# EAGLE design PoE_RFID (EAGLE 8.5.0)

## Sheet 1 of 2
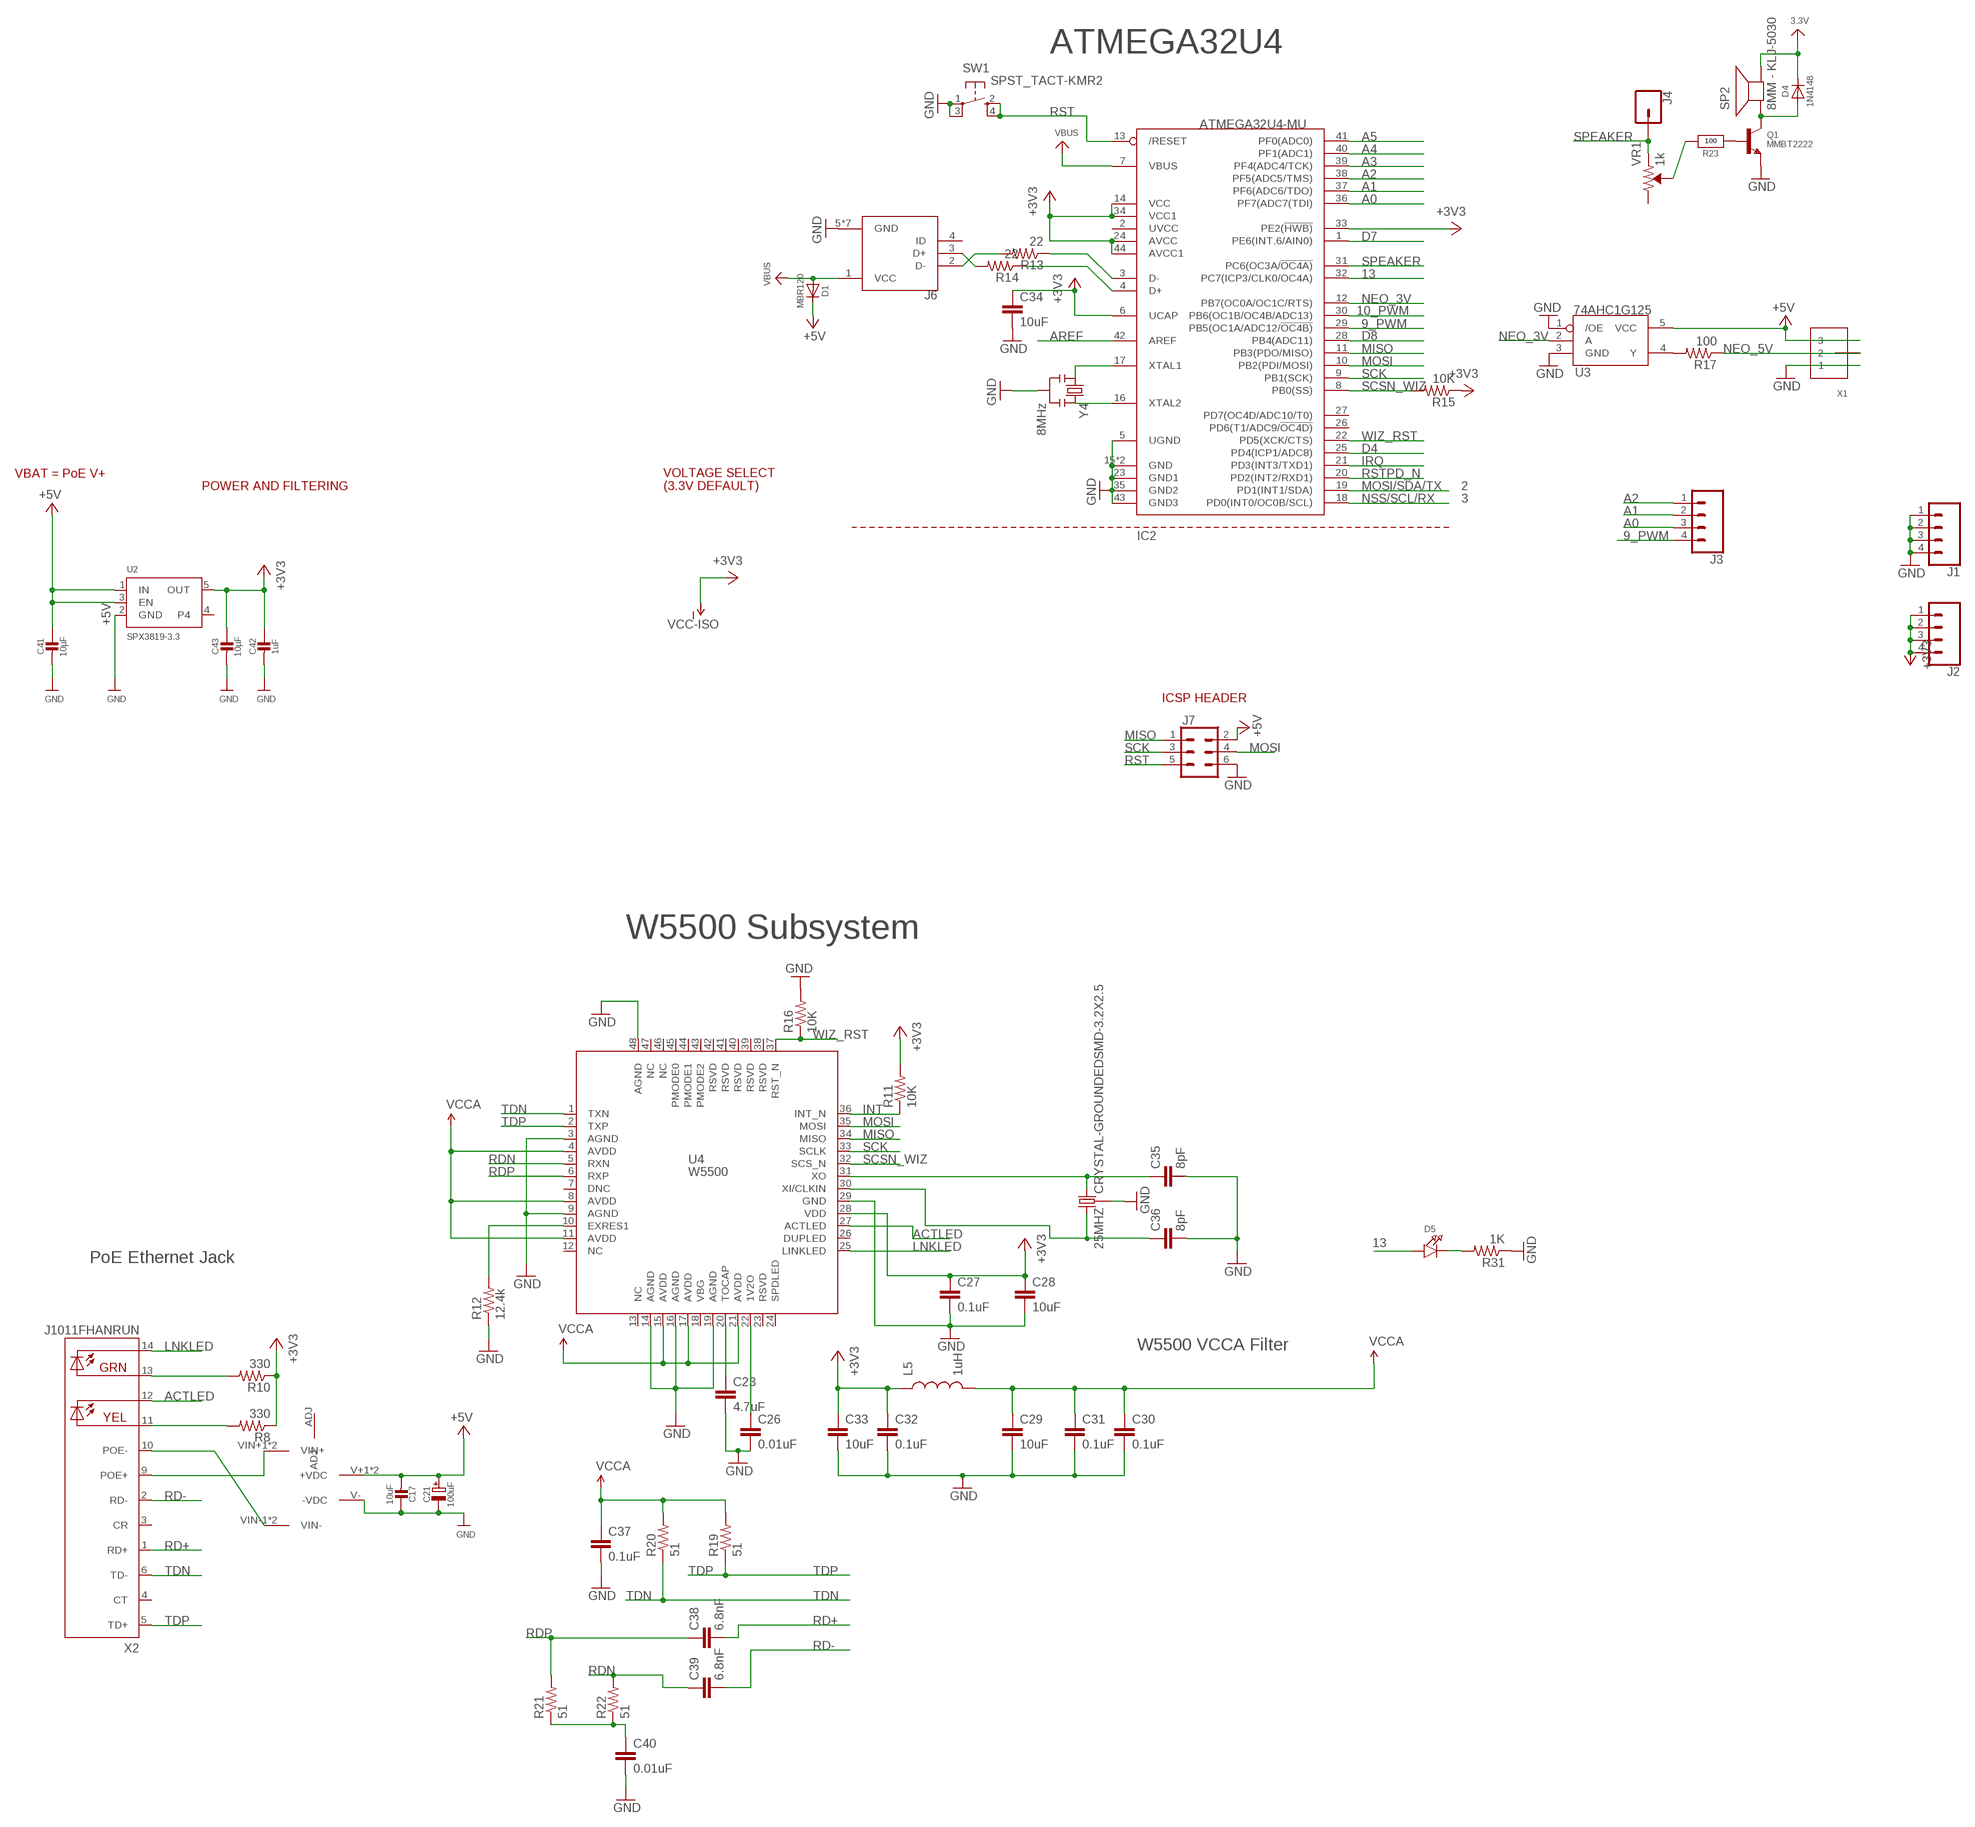
[diagram p0: schematic, sheet 1]

### Parts
25MHZ  CRYSTAL-GROUNDEDSMD-3.2X2.5  [CRYSTAL-SMD-3.2X2.5MM]
C17  10uF  CAP_CERAMIC_0805MP  [_0805MP]
C21  100uF  CAP_ELECTROLYTICPANASONIC_C  [PANASONIC_C]
C23  4.7uF  CAP0603-CAP  [0603-CAP]
C26  0.01uF  CAP0603-CAP  [0603-CAP]
C27  0.1uF  CAP0603-CAP  [0603-CAP]
C28  10uF  CAP0603-CAP  [0603-CAP]
C29  10uF  CAP0603-CAP  [0603-CAP]
C30  0.1uF  CAP0603-CAP  [0603-CAP]
C31  0.1uF  CAP0603-CAP  [0603-CAP]
C32  0.1uF  CAP0603-CAP  [0603-CAP]
C33  10uF  CAP0603-CAP  [0603-CAP]
C34  10uF  CAP0603-CAP  [0603-CAP]
C35  8pF  CAP0603-CAP  [0603-CAP]
C36  8pF  CAP0603-CAP  [0603-CAP]
C37  0.1uF  CAP0603-CAP  [0603-CAP]
C38  6.8nF  CAP0603-CAP  [0603-CAP]
C39  6.8nF  CAP0603-CAP  [0603-CAP]
C40  0.01uF  CAP0603-CAP  [0603-CAP]
C41  10µF  CAP_CERAMIC0603_NO  [0603-NO]
C42  1uF  CAP_CERAMIC0603_NO  [0603-NO]
C43  10µF  CAP_CERAMIC0603_NO  [0603-NO]
D1  MBR120  DIODESOD-123  [SOD-123]
D4  1N4148  DIODESOD-323  [SOD-323]
D5  LED0805_NOOUTLINE  [CHIPLED_0805_NOOUTLINE]
IC2  ATMEGA32U4-MU  [TQFN44_7MM]
J1  CONN_04  [1X04]
J2  CONN_04  [1X04]
J3  CONN_041X04_NO_SILK  [1X04_NO_SILK]
J4  CONN_01  [1X01]
J6  10103594-0001LF  [FCI_10103594-0001LF]
J7  CONN_03X2NO_SILK  [2X3-NS]
L5  1uH  INDUCTOR0603  [0603]
Q1  MMBT2222  TRANSISTOR_NPNWIDE  [SOT23-WIDE]
R8  330  RESISTOR0603-RES  [0603-RES]
R10  330  RESISTOR0603-RES  [0603-RES]
R11  10K  RESISTOR0603-RES  [0603-RES]
R12  12.4k  RESISTOR0603-RES  [0603-RES]
R13  22  RESISTOR0603-RES  [0603-RES]
R14  22  RESISTOR0603-RES  [0603-RES]
R15  10K  RESISTOR0603-RES  [0603-RES]
R16  10K  RESISTOR0603-RES  [0603-RES]
R17  100  RESISTOR0603-RES  [0603-RES]
R19  51  RESISTOR0603-RES  [0603-RES]
R20  51  RESISTOR0603-RES  [0603-RES]
R21  51  RESISTOR0603-RES  [0603-RES]
R22  51  RESISTOR0603-RES  [0603-RES]
R23  100  RESISTOR_0603_NOOUT  [0603-NO]
R31  1K  RESISTOR0603-RES  [0603-RES]
SP2  8MM - KLJ-5030  SPEAKER_BUZZER5MM  [BUZZER_SMT_5MM]
SW1  SPST_TACT-KMR2  [KMR2]
U2  SPX3819-3.3  VREG_SOT23-5  [SOT23-5]
U3  74AHC1G125  [SOT23-5]
U4  W5500  [W5500]
U$1  SILVERTEL_POEMICRO  [AG9900]
VR1  1k  TRIMPOT-SMD-3MM-OPEN-1/10W-25%  [TRIMPOT-SMD-TC33X]
X1  TERMBLOCK_1X3  [TERMBLOCK_1X3-3.5MM]
X2  J1011FHANRUN  [HANRUN_POE]
Y4  8MHz  RESONATORSMD  [RESONATOR-SMD]

### Nets
3.3V: D4.C SP2.-
9_PWM: IC2.29(PB5(OC1A/ADC12/!OC4B)) J3.4
10_PWM: IC2.30(PB6(OC1B/OC4B/ADC13))
13: D5.A IC2.32(PC7(ICP3/CLK0/OC4A))
+3V3: C27.1 C28.1 C32.1 C33.1 C34.1 C42.1 C43.1 IC2.6(UCAP) IC2.14(VCC) IC2.24(AVCC) IC2.33(PE2(!HWB)) IC2.34(VCC1) IC2.44(AVCC1) J2.1 J2.2 J2.3 J2.4 L5.1 R8.1 R10.1 R11.2 R15.1 U2.5(OUT) U4.28(VDD) ; supply symbol labelled VCC-ISO ; also sheet 2
+5V [usbvcc]: C17.2 C21.+ C41.1 D1.C J7.2 U2.1(IN) U2.3(EN) U3.5(VCC) U$1.V+1(+VDC) U$1.V+2(+VDC) X1.3
A0: IC2.36(PF7(ADC7(TDI)) J3.3
A1: IC2.37(PF6(ADC6/TDO)) J3.2
A2: IC2.38(PF5(ADC5/TMS)) J3.1
A3: IC2.39(PF4(ADC4/TCK))
A4: IC2.40(PF1(ADC1))
A5: IC2.41(PF0(ADC0))
ACTLED: U4.27(ACTLED) X2.12(YEL-C)
AREF: IC2.42(AREF)
D4: IC2.25(PD4(ICP1/ADC8))
D7: IC2.1(PE6(INT.6/AIN0))
D8: IC2.28(PB4(ADC11))
D+: IC2.4(D+) R14.1
D-: IC2.3(D-) R13.1
GND: 25MHZ.2 25MHZ.4 C17.1 C21.- C23.2 C26.2 C27.2 C28.2 C29.2 C30.2 C31.2 C32.2 C33.2 C34.2 C35.2 C36.2 C37.2 C40.2 C41.2 C42.2 C43.2 IC2.5(UGND) IC2.15(GND) IC2.23(GND1) IC2.35(GND2) IC2.43(GND3) IC2.THERMAL(GND) J1.1 J1.2 J1.3 J1.4 J6.5(GND) J6.P1(GND) J6.P2(GND) J6.P3(GND) J6.P4(GND) J6.P5(GND) J6.P6(GND) J7.6 Q1.2(E) R12.1 R16.2 R31.1 SW1.1(P) SW1.3(P1) U2.2(GND) U3.1(/OE) U3.3(GND) U4.3(AGND) U4.9(AGND) U4.14(AGND) U4.16(AGND) U4.19(AGND) U4.29(GND) U4.48(AGND) U$1.V-(-VDC) X1.1 Y4.2 ; also sheet 2
INT: R11.1 U4.36(INT_N)
IRQ: IC2.21(PD3(INT3/TXD1)) ; also sheet 2
LNKLED: U4.25(LINKLED) X2.14(GRN-C)
MISO: IC2.11(PB3(PDO/MISO)) J7.1 U4.34(MISO)
MOSI: IC2.10(PB2(PDI/MOSI)) J7.4 U4.35(MOSI)
MOSI/SDA/TX: IC2.19(PD1(INT1/SDA)) ; also sheet 2
N$6: U$1.VIN-1(VIN-) U$1.VIN-2(VIN-) X2.10(POE-)
N$15: U$1.VIN+1(VIN+) U$1.VIN+2(VIN+) X2.9(POE+)
N$16: C26.1 U4.22(1V2O)
N$17: IC2.16(XTAL2) Y4.3
N$18: C23.1 U4.20(TOCAP)
N$19: R17.2 U3.4(Y)
N$20: R12.2 U4.10(EXRES1)
N$21: IC2.17(XTAL1) Y4.1
N$22: J6.3(D+) R14.2
N$23: C40.1 R21.1 R22.1
N$24: J6.2(D-) R13.2
N$25: 25MHZ.3 C35.1 U4.31(XO)
N$26: 25MHZ.1 C36.1 U4.30(XI/CLKIN)
N$27: R8.2 X2.11(YEL-A)
N$28: R10.2 X2.13(GRN-A)
N$29: Q1.1(B) R23.1
N$30: D4.A Q1.3(C) SP2.+
N$31: R23.2 VR1.2(WIPER)
N$33: D5.C R31.2
NEO_3V: IC2.12(PB7(OC0A/OC1C/RTS)) U3.2(A)
NEO_5V: R17.1 X1.2
NSS/SCL/RX: IC2.18(PD0(INT0/OC0B/SCL)) ; also sheet 2
RD+: C38.2 X2.1(RD+)
RD-: C39.2 X2.2(RD-)
RDN: C39.1 R22.2 U4.5(RXN)
RDP: C38.1 R21.2 U4.6(RXP)
RST: IC2.13(/RESET) J7.5 SW1.2(S) SW1.4(S1)
RSTPD_N: IC2.20(PD2(INT2/RXD1)) ; also sheet 2
SCK: IC2.9(PB1(SCK)) J7.3 U4.33(SCLK)
SCSN_WIZ: IC2.8(PB0(SS)) R15.2 U4.32(SCS_N)
SPEAKER: IC2.31(PC6(OC3A/!OC4A)) J4.1 VR1.3(CCW)
TDN: R20.1 U4.1(TXN) X2.6(TD-)
TDP: R19.1 U4.2(TXP) X2.5(TD+)
VBUS: D1.A IC2.7(VBUS) J6.1(VCC)
VCCA: C29.1 C30.1 C31.1 C37.1 L5.2 R19.2 R20.2 U4.4(AVDD) U4.8(AVDD) U4.11(AVDD) U4.15(AVDD) U4.17(AVDD) U4.21(AVDD)
WIZ_RST: IC2.22(PD5(XCK/CTS)) R16.1 U4.37(RST_N)
Unconnected: IC2.2(UVCC) IC2.26(PD6(T1/ADC9/!OC4D)) IC2.27(PD7(OC4D/ADC10/T0)) J6.4(ID) U2.4 U4.7(DNC) U4.12(NC) U4.13(NC) U4.18(VBG) U4.23(RSVD) U4.24(SPDLED) U4.26(DUPLED) U4.38(RSVD) U4.39(RSVD) U4.40(RSVD) U4.41(RSVD) U4.42(RSVD) U4.43(PMODE2) U4.44(PMODE1) U4.45(PMODE0) U4.46(NC) U4.47(NC) U$1.ADJ VR1.1(CW) X2.3(CR) X2.4(CT)

### Notes on the sheet
- ATMEGA32U4
- VBAT = PoE V+
- POWER AND FILTERING
- VOLTAGE SELECT
  (3.3V DEFAULT)
- 2
- 3
- ICSP HEADER
- W5500 Subsystem
- PoE Ethernet Jack
- W5500 VCCA Filter

## Sheet 2 of 2
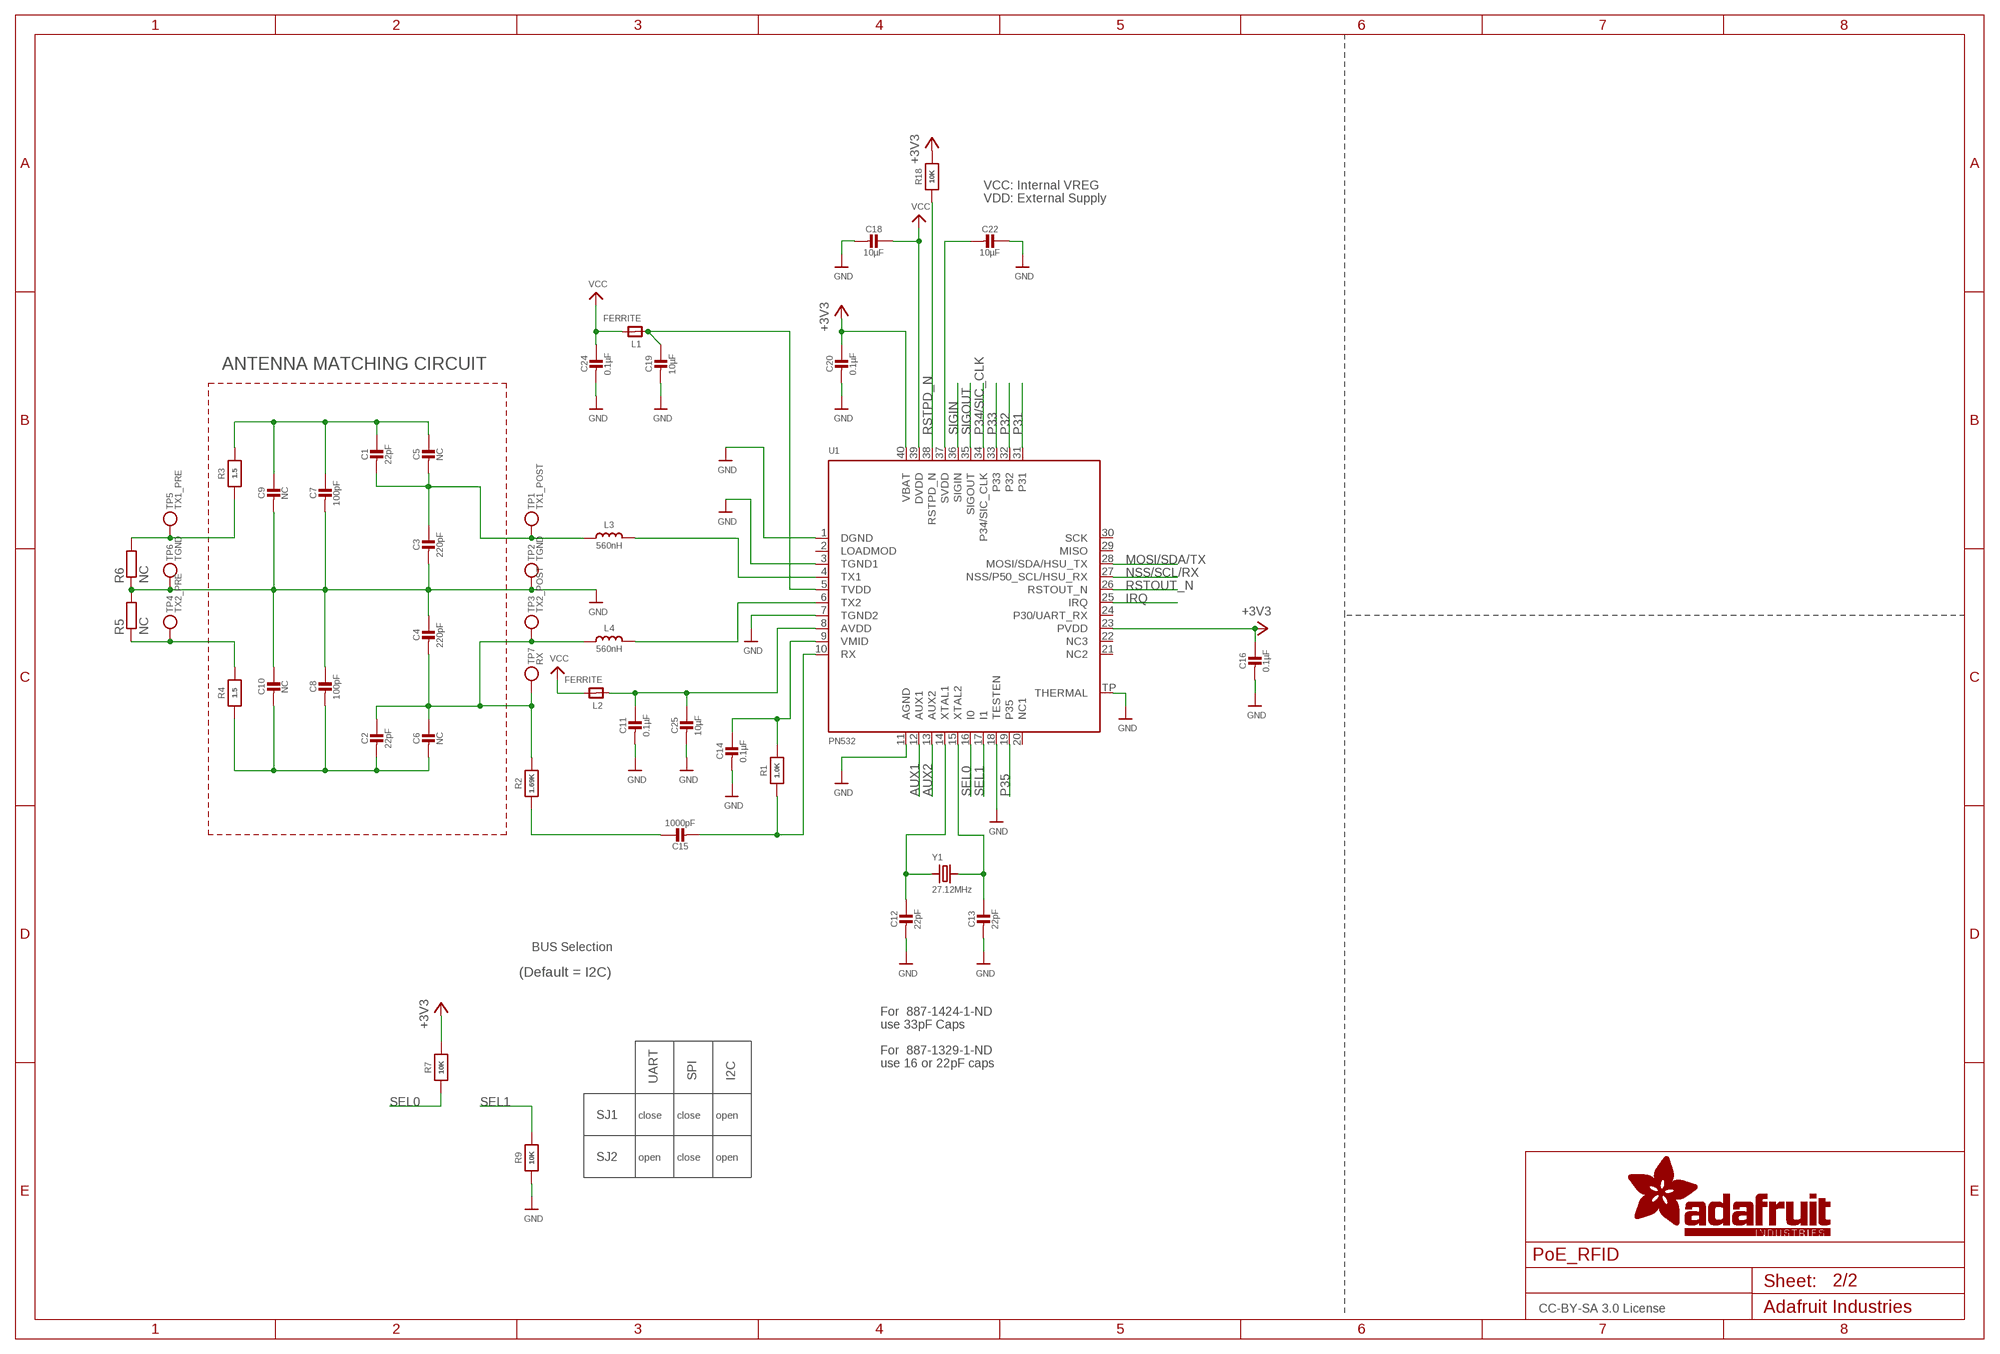
[diagram p1: schematic, sheet 2]

### Parts
C1  22pF  CAP_CERAMIC0603_NO  [0603-NO]
C2  22pF  CAP_CERAMIC0603_NO  [0603-NO]
C3  220pF  CAP_CERAMIC0603_NO  [0603-NO]
C4  220pF  CAP_CERAMIC0603_NO  [0603-NO]
C5  NC  CAP_CERAMIC0603_NO  [0603-NO]
C6  NC  CAP_CERAMIC0603_NO  [0603-NO]
C7  100pF  CAP_CERAMIC0603_NO  [0603-NO]
C8  100pF  CAP_CERAMIC0603_NO  [0603-NO]
C9  NC  CAP_CERAMIC0603_NO  [0603-NO]
C10  NC  CAP_CERAMIC0603_NO  [0603-NO]
C11  0.1µF  CAP_CERAMIC0603_NO  [0603-NO]
C12  22pF  CAP_CERAMIC0603_NO  [0603-NO]
C13  22pF  CAP_CERAMIC0603_NO  [0603-NO]
C14  0.1µF  CAP_CERAMIC0603_NO  [0603-NO]
C15  1000pF  CAP_CERAMIC0603_NO  [0603-NO]
C16  0.1µF  CAP_CERAMIC0603_NO  [0603-NO]
C18  10µF  CAP_CERAMIC0603_NO  [0603-NO]
C19  10µF  CAP_CERAMIC0603_NO  [0603-NO]
C20  0.1µF  CAP_CERAMIC0603_NO  [0603-NO]
C22  10µF  CAP_CERAMIC0603_NO  [0603-NO]
C24  0.1µF  CAP_CERAMIC0603_NO  [0603-NO]
C25  10µF  CAP_CERAMIC0603_NO  [0603-NO]
L1  FERRITE  FERRITE_0603  [_0603]
L2  FERRITE  FERRITE_0603  [_0603]
L3  560nH  INDUCTOR0603_NO  [0603-NO]
L4  560nH  INDUCTOR0603_NO  [0603-NO]
R1  1.0K  RESISTOR_0603_NOOUT  [0603-NO]
R2  1.69K  RESISTOR_0603_NOOUT  [0603-NO]
R3  1.5  RESISTOR_0603_NOOUT  [0603-NO]
R4  1.5  RESISTOR_0603_NOOUT  [0603-NO]
R5  NC  R-EU_R0201  [R0201]
R6  NC  R-EU_R0201  [R0201]
R7  10K  RESISTOR_0603_NOOUT  [0603-NO]
R9  10K  RESISTOR_0603_NOOUT  [0603-NO]
R18  10K  RESISTOR_0603_NOOUT  [0603-NO]
TP1  TX1_POST  TESTPOINT1.5X2.0MM_NOCREAM  [PAD-1.5X2.0]
TP2  TGND  TESTPOINT1.5X2.0MM_NOCREAM  [PAD-1.5X2.0]
TP3  TX2_POST  TESTPOINT1.5X2.0MM_NOCREAM  [PAD-1.5X2.0]
TP4  TX2_PRE  TESTPOINT1.5X2.0MM_NOCREAM  [PAD-1.5X2.0]
TP5  TX1_PRE  TESTPOINT1.5X2.0MM_NOCREAM  [PAD-1.5X2.0]
TP6  TGND  TESTPOINT1.5X2.0MM_NOCREAM  [PAD-1.5X2.0]
TP7  RX  TESTPOINT1.5X2.0MM_NOCREAM  [PAD-1.5X2.0]
U1  PN532  [HVQFN40-6X6]
Y1  27.12MHz  CRYSTAL3.2X2.5  [CRYSTAL_3.2X2.5]

### Nets
+3V3: C16.1 C20.1 R7.2 R18.2 U1.23(PVDD) U1.40(VBAT) ; also sheet 1
AUX1: U1.12(AUX1)
AUX2: U1.13(AUX2)
GND: C3.2 C4.1 C7.2 C8.1 C9.2 C10.1 C11.2 C12.2 C13.2 C14.2 C16.2 C18.2 C19.2 C20.2 C22.1 C24.2 C25.2 R5.2 R6.1 R9.1 TP2.P$1 TP6.P$1 U1.1(DGND) U1.3(TGND1) U1.7(TGND2) U1.11(AGND) U1.18(TESTEN) U1.TP(THERMAL) ; also sheet 1
IRQ: U1.25(IRQ) ; also sheet 1
MOSI/SDA/TX: U1.28(MOSI/SDA/HSU_TX) ; also sheet 1
N$1: L3.2 U1.4(TX1)
N$2: L4.2 U1.6(TX2)
N$3: C1.2 C3.1 C5.2 L3.1 TP1.P$1
N$4: R3.1 R6.2 TP5.P$1
N$5: R4.2 R5.1 TP4.P$1
N$7: C12.1 U1.14(XTAL1) Y1.1
N$8: C13.1 U1.15(XTAL2) Y1.2
N$9: C15.1 R2.1
N$10: C14.1 R1.2 U1.9(VMID)
N$11: C15.2 R1.1 U1.10(RX)
N$12: C2.1 C4.2 C6.1 L4.1 R2.2 TP3.P$1 TP7.P$1
N$13: C11.1 C25.1 L2.1 U1.8(AVDD)
N$14: C19.1 L1.1 U1.5(TVDD)
N$55: C22.2 U1.37(SVDD)
NSS/SCL/RX: U1.27(NSS/P50_SCL/HSU_RX) ; also sheet 1
P31: U1.31
P32: U1.32
P33: U1.33
P34/SIC_CLK: U1.34(P34/SIC_CLK)
P35: U1.19(P35)
RSTOUT_N: U1.26(RSTOUT_N)
RSTPD_N: R18.1 U1.38(RSTPD_N) ; also sheet 1
SEL0: R7.1 U1.16(I0)
SEL1: R9.2 U1.17(I1)
SIGIN: U1.36(SIGIN)
SIGOUT: U1.35(SIGOUT)
TX1_ANTENNA: C1.1 C5.1 C7.1 C9.1 R3.2
TX2_ANTENNA: C2.2 C6.2 C8.2 C10.2 R4.1
VCC: C18.1 C24.1 L1.2 L2.2 U1.39(DVDD)
Unconnected: U1.2(LOADMOD) U1.20(NC1) U1.21(NC2) U1.22(NC3) U1.24(P30/UART_RX) U1.29(MISO) U1.30(SCK)

### Notes on the sheet
- VCC: Internal VREG
- VDD: External Supply
- ANTENNA MATCHING CIRCUIT
- BUS Selection
- (Default = I2C)
- For  887-1424-1-ND
- use 33pF Caps
- For  887-1329-1-ND
- use 16 or 22pF caps
- UART | SPI | I2C
- SJ1 | close | close | open
- SJ2 | open | close | open
- CC-BY-SA 3.0 License

## Library data of the parts
25MHZ = SparkFun-Clocks:CRYSTAL-GROUNDED: Crystals w/ Ground Pin (Generic) These are passive quartz crystals, which can be used as a clock source for a microcontroller. Crystal's are usually two-terminal devices. A third terminal may be optionally connected to ground, as recommended by the manufaturer.
C1-C20 C22 C24 C25 C41-C43 = microbuilder:CAP_CERAMIC: Ceramic Capacitors For new designs, use the packages preceded by an '_' character since they are more reliable: The following footprints should be used on most boards: _0402 - Standard footprint for regular board layouts _0603 - Standard footprint for regular board layouts _0805 - Standard footprint for regular board layouts _1206 - Standard footprint for regular board layouts For extremely tight-pitch boards where space is at a premium, the following 'micro-pitch' footprints can be used (smaller pads, no silkscreen outline, etc.): _0402MP - Micro-pitch footprint for very dense/compact boards _0603MP - Micro-pitch footprint for very dense/compact boards _0805MP - Micro-pitch footprint for very dense/compact boards _1206MP - Micro-pitch footprint for very dense/compact boards
C21 = microbuilder:CAP_ELECTROLYTIC: Electrolytic Capacitors SMT PANASONIC_C - Size C Panasonic Electrolytic Aluminum Capacitor 47µF 16V 20% Electrolytic Capacitor [Digikey: PCE3890TR-ND] PANASONIC_D - Size D Panasonic Electrolytic Aluminum Capacitor 100µF 25V 20% Electrolytic Capacitor [Digikey: PCE3898TR-ND] PTH 3.5 mm grid, 8 mm diameter ... 3.5 mm grid, 10 mm diameter ...
C23 C26-C40 = SparkFun-Passives:CAP: Capacitor Standard 0603 ceramic capacitor, and 0.1" leaded capacitor.
D1 D4 = microbuilder:DIODE: Diode SMA Model Volts Amps Type Vf Ir Digikey # Notes SSA34-E3 40V 3A Schottky 480mV @ 3A 200uA @ 40V SSA34-E3/61TGITR-ND CDBA120-G 20V 1A Schottky 500mV @ 1A 500uA @ 20V 641-1014-6-ND REEL MBRA210 10V 2A Schottky 350mV @ 2A 700uA @ 10V MBRA210LT3 SOD-123 Model Volts Amps Type Vf Ir Order # Notes BAT54T1G 30V 200mA Schottky 800mV @ 200mA 2uA @ 25V BAT54T1GOSTR-ND B0530W 30V 500mA Schottky 430mV @ 500mA 130uA @ 30V B0530W-FDICT-ND REEL MBR120 20V 1A Schottky 340mV @ 1A MBR120VLSFT1GOSCT-ND SOD-323 Model Volts Amps Type Vf Ir Order # Notes PMEG2005EJ 20V 500mA Schottky 355mV @ 500mA 568-4110-1-ND ZLLS410 10V 570mA Schottky 380mV @ 570mA ZLLS410CT-ND 1N4148WS 75V 150mA Silicon/Simple 1V 1N4148WSFSCT-ND REEL SOD-523 Model Volts Amps Type Vf Ir Order # Notes BAT54XV2 30V 200mA Schottky 0.8V @ 100mA BAT54XV2CT-ND TB751S 30V 30mA Schottky RB751S-40TE61CT-ND SOT23-R/W (R = Solder Paste/Reflow Ovens, W = Hand-Soldering) Model Volts Amps Type Vf Ir Order # Notes BAT54FILM 40V 300mA Schottky 497-7162-1-ND POWERDI-5 Model Volts Amps Type Vf Ir Order # Notes PDS560 60V 5A Schottky 670mV @ 5A 150uA @ 60V PDS560DICT-ND
D5 = microbuilder:LED: LED 0603 - 0603 Surface Mount Package 2mA: Green LED - Low Power (3.9mcd, 2ma, 1.7Vf) - Digikey: 475-2709-2-ND Orange LED - Low Power (9.8mcd, 2ma, 1.8Vf) - Digikey: 475-1194-2-ND Red LED - Low Power (5mcd, 2ma, 1.8Vf) - Digikey: 475-1195-2-ND Yellow LED - Low Power (7mcd, 2ma, 1.8Vf) - Digikey: 475-1196-2-ND 5mA: Blue LED - Low Power (17mcd, 5ma, 2.9Vf) - Digikey: LNJ937W8CRACT-ND 0805 - 0805 Surface Mount Package 2mA: Red LED (8.8mcd, 2mA, 1.8Vf, Clear) - Low Power [Digikey: 475-2510-1-ND] Green LED (5mcd, 2mA, 1.8Vf, Clear) - Low Power [Digikey: 475-2730-1-ND] Yellow LED (11.3mcd, 2mA, 1.8Vf, Clear) - Low Power [Digikey: 475-2555-1-ND] 20mA: Red LED (104mcd, 20mA, Diffused) - LS R976 [Digikey: 475-1278-6-ND] Red LED (12mcd, 20mA, 2.0Vf, Clear) - APT2012EC [Digikey: 754-1128-1-ND] Green LED (15mcd, 20mA, 2.2Vf, Clear) - APT2012GC [Digikey: 754-1131-1-ND] Orange LED (160mcd, 20mA, 2.1Vf, Clear) - APT2012SECK [Digikey: 754-1130-1-ND] 1206 - 1206 Surface Mount Package Green LED (26mcd, 20mA, Diffused) - LG N971 [Digikey: 475-1407-6-ND] Red LED (15mcd, 20mA, Diffused) - LH N974 [Digikey: 475-1416-6-ND] Cree - Cree High-Power Surface Mount LEDs XPEBWT-L1-0000-00D50 - White 111lm 350mA 2.9Vf 6200K 110° XTEAWT-00-0000-00000LEE3 - White 114lm 350mA 2.85Vf 5000K 115° Everlight - Everlight 45-21 Series Surface Mount LEDs 45-21/QK2C-B2832AC2CB2/2T - Warm White 2000mcd 20mA 3.25Vf 3050K 120° 45-21/LK2C-B38452C4CB2/2T - Nuetral White 2000mcd 20mA 3.25Vf 4150K 120° 45-21/LK2C-B50634C6CB2/2T - Cold White 2200mcd 20mA 3.25Vf 5650K 120° PLCC2 Reverse Mount LS T77K-J1L2-1-0-2-R18-Z - Red 11.25mcd 2mA 1.8Vf 630nm 120° LO T77K-L1M2-24-Z - Orange 19.6mcd 2mA 1.8Vf 606nm 120° LY T77K-K2M1-26-Z - Yellow 15.7mcd 2mA 1.8Vf 587nm 120°
IC2 = microbuilder:ATMEGA32U4: http://www.ladyada.net/library/eagle
J1-J3 = SparkFun-Connectors:CONN_04: Multi connection point. Often used as Generic Header-pin footprint for 0.1 inch spaced/style header connections On any of the 0.1 inch spaced packages, you can populate with these: Break Away Headers - Straight <https://www.sparkfun.com/products/116> (PRT-00116) Break Away Male Headers - Right Angle <https://www.sparkfun.com/products/553> (PRT-00553) Female Headers <https://www.sparkfun.com/products/115> (PRT-00115) Break Away Headers - Machine Pin <https://www.sparkfun.com/products/117> (PRT-00117) Break Away Female Headers - Swiss Machine Pin <https://www.sparkfun.com/products/743> (PRT-00743) For SCREWTERMINALS and SPRING TERMINALS visit here: Screw Terimnals on SparkFun.com <https://www.sparkfun.com/search/results?term=Screw+Terminals> (5mm/3.5mm/2.54mm spacing) This device is also useful as a general connection point to wire up your design to another part of your project. Our various solder wires solder well into these plated through hole pads. Hook-Up Wire - Assortment (Stranded, 22 AWG) <https://www.sparkfun.com/products/11375> (PRT-11375) Hook-Up Wire - Assortment (Solid Core, 22 AWG) <https://www.sparkfun.com/products/11367> (PRT-11367) View the entire wire category on our website here <https://www.sparkfun.com/categories/141> Special notes: Molex polarized connector foot print use with SKU : PRT-08231 with associated crimp pins and housings. 1MM SMD Version SKU: PRT-10208; PROD_ID: CONN-09696
J4 = SparkFun-Connectors:CONN_01: Single connection point. Often used as Generic Header-pin footprint for 0.1 inch spaced/style header connections On any of the 0.1 inch spaced packages, you can populate with these: Break Away Headers - Straight <https://www.sparkfun.com/products/116> (PRT-00116) Break Away Male Headers - Right Angle <https://www.sparkfun.com/products/553> (PRT-00553) Female Headers <https://www.sparkfun.com/products/115> (PRT-00115) Break Away Headers - Machine Pin <https://www.sparkfun.com/products/117> (PRT-00117) Break Away Female Headers - Swiss Machine Pin <https://www.sparkfun.com/products/743> (PRT-00743) This device is also useful as a general connection point to wire up your design to another part of your project. Our various solder wires solder well into these plated through hole pads. Hook-Up Wire - Assortment (Stranded, 22 AWG) <https://www.sparkfun.com/products/11375> (PRT-11375) Hook-Up Wire - Assortment (Solid Core, 22 AWG) <https://www.sparkfun.com/products/11367> (PRT-11367) View the entire wire category on our website here <https://www.sparkfun.com/categories/141> Special notes: SMTSO-256-ET is a "flush mount" nut for a 4-40 screw. We mostly use this on specialty testbeds; it is a nice way to connect hardware to your PCB at an adjustable hieght. Also note, the SNAP packages are for using a snappable style connector. We sell a baggie of snaps and they are also used on two LilyPad designs: Snap Assortment - 30 pack (male and female) <https://www.sparkfun.com/products/11347> (DEV-11347) LilyPad Arduino SimpleSnap <https://www.sparkfun.com/products/10941> (DEV-10941) LilyPad SimpleSnap Protoboard <https://www.sparkfun.com/products/10940> (DEV-10940)
J6 = 10103594-0001LF:10103594-0001LF: Conn Micro USB Type B RCP 5 POS 0.65mm Solder RA SMD 5 Terminal 1 Port T/R; AVAILABILITY: Good; DESCRIPTION: Conn Micro USB Type B RCP 5 POS 0.65mm Solder RA SMD 5 Terminal 1 Port T/R; MF: FCI; MP: 10103594-0001LF; PACKAGE: None; PRICE: 0.40 USD
J7 = SparkFun-Connectors:CONN_03X2: Multi connection point. Often used as Generic Header-pin footprint for 0.1 inch spaced/style header connections You can populate with any combo of single row headers, but if you'd like an exact match, check these: Header - 2x3 (Male, 0.1") <https://www.sparkfun.com/products/12807> (PRT-12807) Header - 2x3 (Female, 0.1") <https://www.sparkfun.com/products/13010> (PRT-13010) 2x3 Pin Shrouded Header <https://www.sparkfun.com/products/10877> (PRT-10877) On any of the 0.1 inch spaced packages, you can populate with these: Break Away Headers - Straight <https://www.sparkfun.com/products/116> (PRT-00116) Break Away Male Headers - Right Angle <https://www.sparkfun.com/products/553> (PRT-00553) Female Headers <https://www.sparkfun.com/products/115> (PRT-00115) Break Away Headers - Machine Pin <https://www.sparkfun.com/products/117> (PRT-00117) Break Away Female Headers - Swiss Machine Pin <https://www.sparkfun.com/products/743> (PRT-00743) Special note: the shrouded connector mates well with our 3x2 ribbon cables: Ribbon Crimp Connector - 6-pin (2x3, Female) <https://www.sparkfun.com/products/10651> (PRT-10651) Ribbon Cable - 6 wire (15ft) <https://www.sparkfun.com/products/10646> (PRT-10646)
L1 L2 = microbuilder:FERRITE: Ferrite Bead 0603 MMZ1608B121C - 120 Ohm @ 100MHz, 600mA, 0.15 Ohm DC Resistance - Digikey: 445-2164-1-ND BK1608HW121-T - 120 Ohm, 600mA Ferrite Chip - Digikey: 587-1876-2-ND 0805 HZ0805B272R-10 - 2.7K Ohm @ 100MHz, 200mA, 0.8 Ohm DC Resistance - Digikey: 240-2504-1-ND (see also Murata BLM21BD272SN1L) MMZ2012Y152B - 1.5K Ohm @ 100MHz, 500mA, 0.4 Ohm DC Resistance - Digikey: 445-1560-1-ND - Mainly for high frequency (80-400MHz) MMZ2012R102A - 1K Ohm @ 100MHz, 500mA, 0.3 Ohm DC Resistance - Digikey: 445-1555-2-ND - More general purpose (10-200MHz)
L3 L4 = microbuilder:INDUCTOR: Inductors
L5 = SparkFun-Passives:INDUCTOR: Inductors
Q1 = microbuilder:TRANSISTOR_NPN: NPN Transistor Transistor (NPN) 500mA 45V - BC817 [Digikey: 568-1631-1-ND] Transistor (NPN) 500mA 45V - BC817,215 [Mouser: 771-BC817-T/R] SOT23-R - SOT23 footprint optimised for use with solder paste and reflow ovens. SOT23-W - SOT23 footprint optimised for hand-soldering (larger pads).
R1-R4 R7 R9 R18 R23 = microbuilder:RESISTOR: Resistors For new designs, use the packages preceded by an '_' character since they are more reliable: The following footprints should be used on most boards: _0402 - Standard footprint for regular board layouts _0603 - Standard footprint for regular board layouts _0805 - Standard footprint for regular board layouts _1206 - Standard footprint for regular board layouts For extremely tight-pitch boards where space is at a premium, the following 'micro-pitch' footprints can be used (smaller pads, no silkscreen outline, etc.): _0402MP - Micro-pitch footprint for very dense/compact boards _0603MP - Micro-pitch footprint for very dense/compact boards _0805MP - Micro-pitch footprint for very dense/compact boards _1206MP - Micro-pitch footprint for very dense/compact boards
R5 R6 = rcl:R-EU_: RESISTOR, European symbol
R8 R10-R17 R19-R22 R31 = SparkFun-Passives:RESISTOR: Resistor Basic schematic elements and footprints for 0603, 1206, and PTH resistors.
SP2 = microbuilder:SPEAKER: SPEAKER Source: Buerklin Added PS12 (for part # PS1240 piezo) http://www.ladyada.net/library/pcb/eaglelibrary.html
SW1 = adafruit:SPST_TACT: SMT 6mm switch, EVQQ2 series http://www.ladyada.net/library/eagle
TP1-TP7 = microbuilder:TESTPOINT: Test Point Various test points for characterisation and PCB testing TESTPOINT_SMT - Compact Surface Mount Test Point [Digikey: 5016KTR-ND]
U1 = microbuilder:PN532: PN532 - Near Field Communication (NFC) controller Highly integrated transceiver module for contactless communication at 13.56 MHz (14443A/MIFARE, FeliCa, I4443B)
U2 = microbuilder:VREG_SOT23-5: SOT23-5 Fixed Voltage Regulators Part Current Out V Out V In V Dropout θJA (°C/W) TJ (°C) Digikey Part No. ADP121 150mA 3.3V 3.4-5.5V 0.09V @ 150mA -- -- ADP121-AUJZ33R7CT-ND ADP121 150mA 3.0V 3.1-5.5V 0.09V @ 150mA -- -- ADP121-AUJZ30R7CT-ND ADP122 300mA 3.3V 3.4-5.5V 0.085V @ 300mA -- -- ADP122AUJZ-3.3-R7CT-ND ADP1712 300mA 3.3V 3.5-5.5V 0.17V @ 300mA -- -- ADP1712AUJZ-3.3-R7TR-ND AP7311 (Low Cost) 150mA 3.3V 3.5-6V 0.15V @ 150mA -- -- AP7311-33WG-7DICT-ND LD39015M18R 150mA 1.8V 1.9V-5.5V 0.08V @ 100mA -- -- 497-6977-1-ND LP2985A-33DBVR 150mA 3.3V 3.3-16V 0.28V @ 150mA 206 150 296-18479-1-ND MCP1824T-3302E/OT 300mA 3.3V 3.5V-6V 0.2V @ 300mA -- -- MCP1824T-3302E/OTCT-ND MIC5205-2.5YM5 TR 150mA 2.5V 2.7-16V 0.165V @ 150mA -- -- 576-1257-2-ND MIC5205-3.0YM5 TR 150mA 3.0V 3.2V-16V 0.165V @ 150mA -- -- 576-1258-2-ND MIC5205-3.3YM5 TR 150mA 3.3V 3.5V-16V 0.165V @ 150mA -- -- 576-1259-2-ND TPS780330220 150mA 3.3V+2.2V 3.6-5.5V 250mV Max -- -- 296-23332-1-ND TDA3663/N1,135 100mA 3.3V 3.5-45V 0.18V @ 50mA -- -- 568-5343-1-ND Max operating temp can be calculated using θJA, TJ (max junction temperature), and power in watts. Set the "Maximum Ambient Temperature" until it reaches TJ ("Max Junction Temperature"), which is the absolute limit for safe use of the regulator: Heat Sink Temperature Calculator <http://www.daycounter.com/Calculators/Heat-Sink-Temperature-Calculator.phtml> For example, With 12V source into a 3.3V LP2985 and a 30mA load, we are dissipating (12V-3.3V) * 0.03A = 0.261W. With a θJA of 206 °C/W, a TJ of 150°C, and 261mW we can safely use the chip without a heat sink up to 75°C (=147.1°C Junction Temperature).
U3 = SparkFun-DigitalIC:74AHC1G125: Single bus buffer gate with 3-state output; PROD_ID: IC-11920
U4 = W5500:W5500
U$1 = Heep:SILVERTEL_POE
VR1 = SparkFun-Resistors:TRIMPOT: Trimming Potentiometer (Trimpot) Three-terminal potentiometers, with an adjustable wiper and two adjustable resistors. A pot can be used to create a configurable voltage divider, or as a variable resistor. "Trimpots" are a subset of potentiometers, usually intended for "set-and-forget" applications. They're often more delicate than standard potentiometers - rated for fewer turns. Variants PTH-KNOB - PTH Trimpot w/ finger-adjustable knob Trimpot 10K with Knob <https://www.sparkfun.com/products/9806> (COM-09806) Datasheet <http://www.sparkfun.com/datasheets/Components/General/TSR-3386.pdf> SMD-3MM-CLOSED-FRAME - SMD 3mm Square Closed-Frame Trimpot Used on e.g. EasyDriver - Stepper Motor Driver <https://www.sparkfun.com/products/12779> Datasheet <http://www.bitechnologies.com/pdfs/22.pdf> (22AR10KTR) SMD-5MM - SMD 5mm Square Closed-Frame Trimpot Used on e.g. IOIO-OTG - V2.2 <https://www.sparkfun.com/products/13613> Datasheet <http://www.vishay.com/docs/51008/ts53.pdf> (TS53YL502MR10) SMD-3MM-1/10W-25% - 3mm Square Open-Frame Trimpot Used on e.g. SparkFun Shapeoko <https://www.sparkfun.com/products/13899> Datasheet <http://www.bourns.com/docs/Product-Datasheets/TC33.pdf> (TC33X-2-103E); PROD_ID: RES-12428; VALUE: 10k
X1 = microbuilder:TERMBLOCK_1X3: 3.5mm Terminal block http://www.ladyada.net/library/pcb/eaglelibrary.html
X2 = Heep:J1011F: PULSEJACK (TM) 1x1 Tab-UP RJ45 10/100 Base-TX RJ45 1x1 Tab-UP with LEDs 8-pin (J1 series) and 6-pin (JP series) integrated magnetics connector, designed to support applications, such as ADSL modems, LAN-on-Motherboard, and Hub and Switches. Source: www.pulseeng.com .. PulseJack-J402.pdf
Y1 = microbuilder:CRYSTAL: Crystals HC49UP - Surface Mount Crystal 4.0MHz 18pF +/-30ppm Surface Mount Crystal [Digikey: 535-9857-1-ND] 12.0 MHz Surface Mount Crystal [Digikey: 535-9869-6-ND] 25.0 MHz Surface Mount Crystal [Digikey: 535-9078-1-ND] 2.5 x 2.0mm - MEMs SMT Crystal 16.0 MHz 10pF 20ppm 2.5 x 2.0mm Crystal [Digikey -40-85°C: 535-10923-1-ND] 3.2 x 2.5mm - MEMs SMT Crystal 12.0 MHz 8pF 15ppm 3.2 x 2.5mm Crystal [Digikey: -10-70°C: 644-1047-1-ND -40-125°C: 644-1128-1-ND] 40~85°C cheaper: 644-1173-6-ND 16.0 MHz 8pF 15ppm 3.2 x 2.5mm Crystal [Digikey: -10-70°C: 644-1049-1-ND -40-125°C: 644-1129-2-ND]-40~85°C cheaper: 644-1175-6-ND 16.0 MHz 10pF 10ppm 3.2 x 2.5mm Crystal [Digikey: 644-1100-1-ND] 27.12 MHz 18pF 30ppm 3.2 x 2.5mm Crystal [Digikey: 887-1424-1-ND] 27.12MHz 10pF 10ppm 3.2 x 2.5mm Crystal [Digikey: 887-1329-1-ND] 4.9 x 1.8mm - MEMs SMT Crystal 32.768 KHz 12.5pF 20ppm 4.9 x 1.8mm Crystal [Digikey: SE2415CT-ND] 8.0 x 3.8mm - Surface Mount Crystal 32.768kHz 12.5pF 20ppm -40°C-85°C [Digikey: 535-9166-2-ND] Cylinder 32.768KHz Cylinder Crystal (2x6mm body) [Ex. Digikey: 300-8341-2-ND]
Y4 = SparkFun:RESONATOR: Resonator Small SMD resonator. This is the itty bitty 10/20MHz resonators with built in caps. CSTCE10M0G55 and CSTCE20M0V53. Footprint has been reviewed closely but hasn't been tested yet.

## Net classes
3 usbvcc: width 0.305 mm, drill 0.483 mm, clearance 0.203 mm

## Board
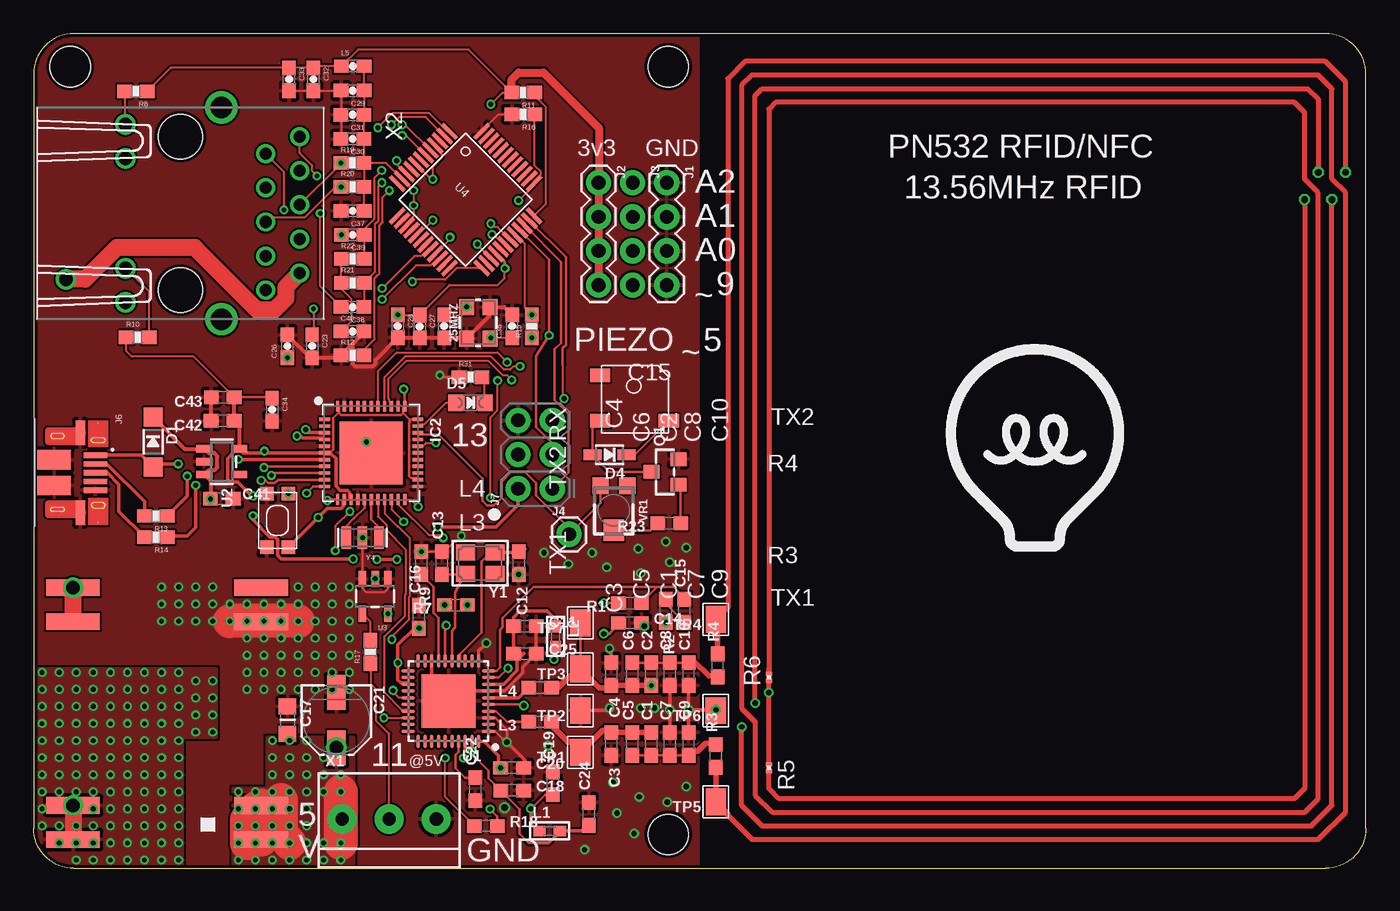
[diagram p2: board, top side]
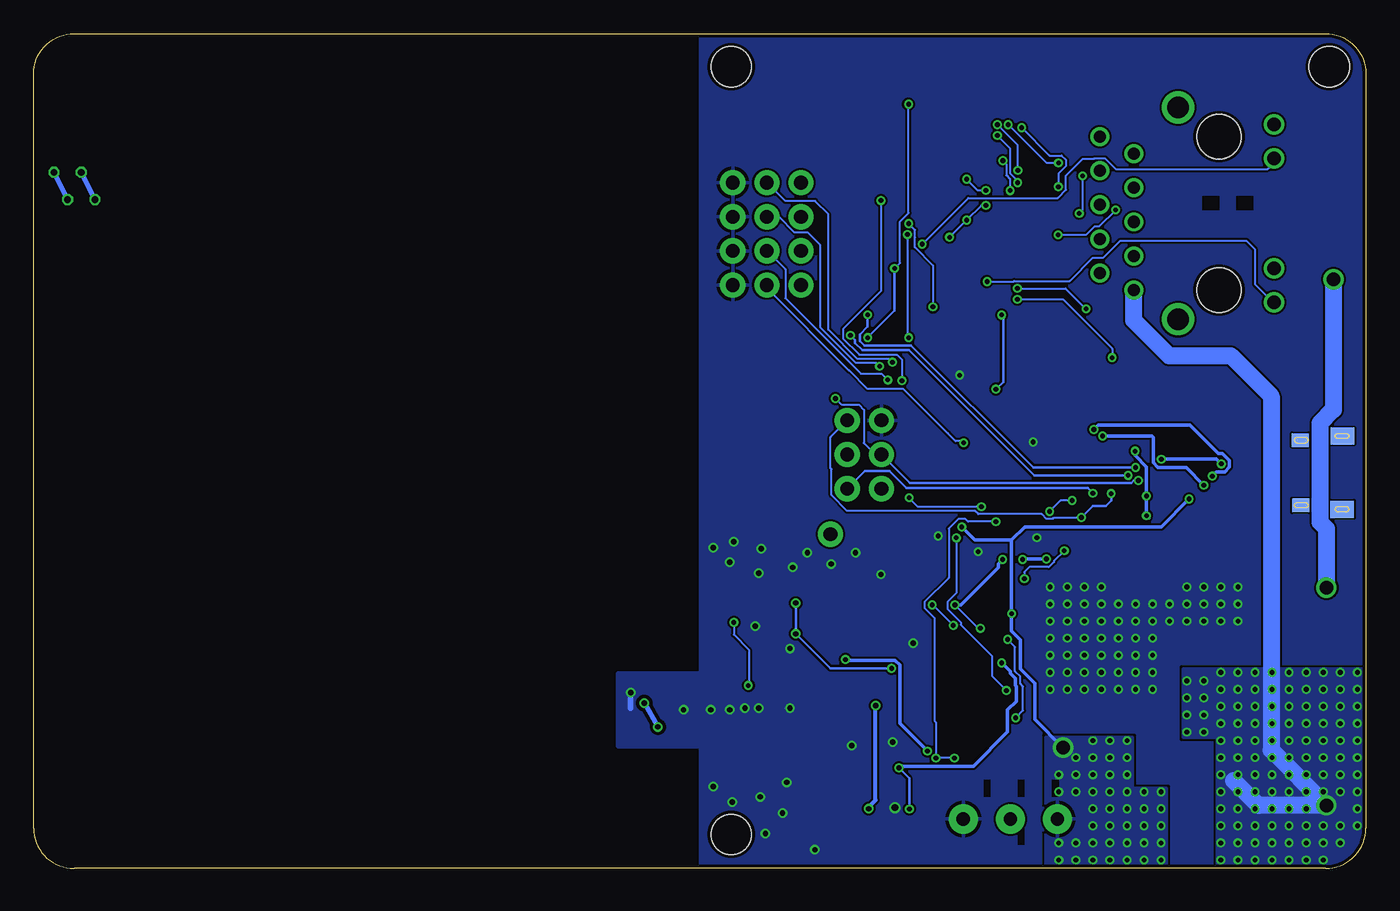
[diagram p3: board, bottom side, seen from below]

Size 99.16 x 62.15 mm. Coordinates in mm from the lower left corner, seen from the top.
Outline: 3,0 96.14,0 arc90 99.16,3 99.16,59.15 arc90 96.14,62.15 3,62.15 arc90 0,59.15 0,3 arc90 3,0
Copper layers (1*16): Top 0.035mm / dielectric 1.5mm / Bottom 0.035mm
Design rules "SeeedStudio_2layer_DRU_no_angle_20140221": minimum track width 6mil, minimum drill 12mil, track to track 6mil, track to pad 6mil, pad to pad 6mil, via to via 6mil, smd to smd 0mil, copper to edge 10mil, drill to drill 10mil, minimum pad ring 10mil, minimum via ring 6mil, stop-mask expansion 2mil, vias tented up to drill 100mil, thermal gap 10mil
Holes 3 mm at 47.23,59.69 47.23,2.54 2.73,59.69
tRestrict: area 29.4,24.9 to 30.1,25; area 28.8,27.2 to 29.1,27.7; area 26.5,25.1 to 27,25.4; area 24.5,27.2 to 24.8,27.7; area 26.3,29.5 to 27.3,29.7; area 29.4,96.3 to 30.1,96.4; area 28.8,98.6 to 29.1,99.1; area 26.5,96.5 to 27,96.8; area 24.5,98.6 to 24.8,99.1; area 26.3,100.8 to 27.3,101.1
bRestrict: area 8.4,49 to 9.7,50; area 10.9,49 to 12.2,50; area 25.4,1.8 to 25.9,3; area 25.4,5.3 to 25.9,6.6; area 22.9,5.3 to 23.4,6.6; area 27.9,5.3 to 28.4,6.6; area 58.5,7.9 to 107.8,45.7; area 58.5,79.2 to 107.8,117.1

### Footprints (pad centres in the part's own frame; a part is rotated, then mirrored left to right if it is on the bottom)
CRYSTAL-SMD-3.2X2.5MM = smd 1.2 x 1.1: 1 -1.175,-0.875; 2 1.175,-0.875; 3 1.175,0.875; 4 -1.175,0.875
0603-NO = smd 1.1 x 1: 1 -0.85,0; 2 0.85,0
_0805MP = smd 1.2 x 1.3: 1 -1.016,0; 2 1.016,0
PANASONIC_C = smd 2.6 x 1.4: + 2.05,0; - -2.05,0
0603-CAP = smd 1.1 x 1: 1 -0.85,0; 2 0.85,0
SOD-123 = smd 1.4 x 1.4: A 1.85,0; C -1.85,0
SOD-323 = smd 1.35 x 0.8: A 1.27,0; C -1.27,0
CHIPLED_0805_NOOUTLINE = smd 1.2 x 1.2: A 0,-1.05; C 0,1.05
TQFN44_7MM = smd 0.25 x 0.8: 1 -2.5,-3.475; 2 -2,-3.475; 3 -1.5,-3.475; 4 -1,-3.475; 5 -0.5,-3.475; 6 0,-3.475; 7 0.5,-3.475; 8 1,-3.475; 9 1.5,-3.475; 10 2,-3.475; 11 2.5,-3.475; 23 2.5,3.475; 24 2,3.475; 25 1.5,3.475; 26 1,3.475; 27 0.5,3.475; 28 0,3.475; 29 -0.5,3.475; 30 -1,3.475; 31 -1.5,3.475; 32 -2,3.475; 33 -2.5,3.475 | smd 0.8 x 0.25: 12 3.475,-2.5; 13 3.475,-2; 14 3.475,-1.5; 15 3.475,-1; 16 3.475,-0.5; 17 3.475,0; 18 3.475,0.5; 19 3.475,1; 20 3.475,1.5; 21 3.475,2; 22 3.475,2.5; 34 -3.475,2.5; 35 -3.475,2; 36 -3.475,1.5; 37 -3.475,1; 38 -3.475,0.5; 39 -3.475,0; 40 -3.475,-0.5; 41 -3.475,-1; 42 -3.475,-1.5; 43 -3.475,-2; 44 -3.475,-2.5 | smd 4.7 x 4.7: THERMAL 0,0
1X04 = drill 1.016 pad 1.88: 1 0,0; 2 2.54,0; 3 5.08,0; 4 7.62,0
1X04_NO_SILK = drill 1.016 pad 1.88: 1 0,0; 2 2.54,0; 3 5.08,0; 4 7.62,0
1X01 = drill 1.016 pad 1.88: 1 0,0
FCI_10103594-0001LF = smd 0.4 x 1.75: 1 -1.3,2.825; 2 -0.65,2.825; 3 0,2.825; 4 0.65,2.825; 5 1.3,2.825 | smd 0.1 x 0.1: P1 -3.7,3; P2 3.7,3 | smd 1.825 x 0.7: P3 -2.987,1.7; P4 2.987,1.7 | smd 1.425 x 2.5: P5 -0.963,-0.25; P6 0.963,-0.25 | smd 1.25 x 1.75 bottom: P$1 -2.731,-0.026; P$2 2.726,-0.018 | smd 1 x 1.25 bottom: P$3 -2.422,3.111; P$4 2.427,3.078
2X3-NS = drill 1.016 pad 1.88: 1 -2.54,-1.27; 2 -2.54,1.27; 3 0,-1.27; 4 0,1.27; 5 2.54,-1.27; 6 2.54,1.27
_0603 = smd 0.9 x 0.8: 1 -0.762,0; 2 0.762,0
0603 = smd 1.1 x 1: 1 -0.85,0; 2 0.85,0
SOT23-WIDE = smd 1 x 1.2: 1 -0.95,-1; 2 0.95,-1; 3 0,1
R0201 = smd 0.28 x 0.43: 1 -0.255,0; 2 0.255,0
0603-RES = smd 1.1 x 1: 1 -0.85,0; 2 0.85,0
BUZZER_SMT_5MM = smd 1.5 x 1: + -2.6,-1.6; - 2.5,-1.6; MT -2.6,1.8
KMR2 = smd 1 x 1: 1 2,0.8; 2 2,-0.8; 3 -2,0.8; 4 -2,-0.8
PAD-1.5X2.0 = smd 1.5 x 2: P$1 0,0
HVQFN40-6X6 = smd 1 x 0.25: 1 -2.99,2.25; 2 -2.99,1.75; 3 -2.99,1.25; 4 -2.99,0.75; 5 -2.99,0.25; 6 -2.99,-0.25; 7 -2.99,-0.75; 8 -2.99,-1.25; 9 -2.99,-1.75; 10 -2.99,-2.25; 21 2.99,-2.25; 22 2.99,-1.75; 23 2.99,-1.25; 24 2.99,-0.75; 25 2.99,-0.25; 26 2.99,0.25; 27 2.99,0.75; 28 2.99,1.25; 29 2.99,1.75; 30 2.99,2.25 | smd 0.25 x 1: 11 -2.25,-2.99; 12 -1.75,-2.99; 13 -1.25,-2.99; 14 -0.75,-2.99; 15 -0.25,-2.99; 16 0.25,-2.99; 17 0.75,-2.99; 18 1.25,-2.99; 19 1.75,-2.99; 20 2.25,-2.99; 31 2.25,2.99; 32 1.75,2.99; 33 1.25,2.99; 34 0.75,2.99; 35 0.25,2.99; 36 -0.25,2.99; 37 -0.75,2.99; 38 -1.25,2.99; 39 -1.75,2.99; 40 -2.25,2.99 | smd 4 x 4: TP 0,0
SOT23-5 = smd 0.55 x 1.2: 1 -0.95,-1.3; 2 0,-1.3; 3 0.95,-1.3; 4 0.95,1.3; 5 -0.95,1.3
W5500 = smd 1.5 x 0.3: 1 -4.45,2.75; 2 -4.45,2.25; 3 -4.45,1.75; 4 -4.45,1.25; 5 -4.45,0.75; 6 -4.45,0.25; 7 -4.45,-0.25; 8 -4.45,-0.75; 9 -4.45,-1.25; 10 -4.45,-1.75; 11 -4.45,-2.25; 12 -4.45,-2.75; 25 4.45,-2.75; 26 4.45,-2.25; 27 4.45,-1.75; 28 4.45,-1.25; 29 4.45,-0.75; 30 4.45,-0.25; 31 4.45,0.25; 32 4.45,0.75; 33 4.45,1.25; 34 4.45,1.75; 35 4.45,2.25; 36 4.45,2.75 | smd 0.3 x 1.5: 13 -2.75,-4.45; 14 -2.25,-4.45; 15 -1.75,-4.45; 16 -1.25,-4.45; 17 -0.75,-4.45; 18 -0.25,-4.45; 19 0.25,-4.45; 20 0.75,-4.45; 21 1.25,-4.45; 22 1.75,-4.45; 23 2.25,-4.45; 24 2.75,-4.45; 37 2.75,4.45; 38 2.25,4.45; 39 1.75,4.45; 40 1.25,4.45; 41 0.75,4.45; 42 0.25,4.45; 43 -0.25,4.45; 44 -0.75,4.45; 45 -1.25,4.45; 46 -1.75,4.45; 47 -2.25,4.45; 48 -2.75,4.45
AG9900 = smd 1.25 x 4: ADJ 18.75,0; V+1 0,0; V+2 2.54,0; V- 16.21,0; VIN+1 18.75,14; VIN+2 16.21,14; VIN-1 2.54,14; VIN-2 0,14
TRIMPOT-SMD-TC33X = smd 1.2 x 1.2: 1 -1,-1.825; 3 1,-1.825 | smd 1.5 x 1.6: 2 0,1.5
TERMBLOCK_1X3-3.5MM = drill 1 pad 2.184: 1 3.5,0; 2 0,0; 3 -3.5,0
HANRUN_POE = drill 0.9 pad 1.3: 1 5.715,-8.89; 2 4.445,-6.35; 3 3.175,-8.89; 4 1.905,-6.35; 5 0.635,-8.89; 6 -0.635,-6.35; 7 -1.905,-8.89; 8 -3.175,-6.35; 9 -4.445,-8.89; 10 -5.715,-6.35 | drill 1 pad 1.422: 11 6.625,4.08; 12 4.085,4.08; 13 -4.085,4.08; 14 -6.625,4.08 | drill 1.6 pad 2.184: M1 7.875,-3.05; M2 -7.875,-3.05 | hole 3.3: -5.715,0; 5.715,0
CRYSTAL_3.2X2.5 = smd 1.4 x 1.2: 1 -1.1,-0.8; 2 1.1,0.8; GND1 -1.1,0.8; GND2 1.1,-0.8
RESONATOR-SMD = smd 0.7 x 1.7: 1 -1.2,0; 2 0,0; 3 1.2,0

### Placement (x,y rotation side)
25MHZ  33.1,40.63 90 top
C1  45.96,9.28 90 top
C2  45.96,14.47 90 top
C3  42.98,9.28 270 top
C4  42.98,14.47 270 top
C5  44.57,9.28 90 top
C6  44.57,14.47 90 top
C7  47.36,9.28 90 top
C8  47.36,14.47 90 top
C9  48.75,9.28 90 top
C10  48.75,14.47 90 top
C11  36.56,18.03 0 top
C12  36.1,22.74 270 top
C13  30.39,22.74 90 top
C14  44.38,18.28 0 top
C15  48.43,19.17 90 top
C16  28.69,18.73 90 top
C17  18.91,11.05 270 top
C18  35.62,5.82 0 top
C19  38.65,6.35 90 top
C20  35.61,7.49 0 top
C21  22.54,11.05 270 top
C22  32.87,5.91 90 top
C23  20.73,38.87 270 top
C24  41.32,4.06 90 top
C25  36.56,16 0 top
C26  18.89,38.88 90 top
C27  28.73,40.36 270 top
C28  27.1,40.37 270 top
C29  23.74,57.9 180 top
C30  23.73,54.31 180 top
C31  23.73,56.1 180 top
C32  20.82,58.75 270 top
C33  19.01,58.75 270 top
C34  17.75,34.15 270 top
C35  30.56,40.36 270 top
C36  35.62,40.36 90 top
C37  23.74,48.95 180 top
C38  23.74,41.8 180 top
C39  23.76,47.17 180 top
C40  23.73,39.98 0 top
C41  14.01,27.51 0 top
C42  14.07,33.32 180 top
C43  14.08,35.08 180 top
D1  8.89,31.75 270 top
D4  42.86,30.8 180 top
D5  32.51,34.67 270 top
IC2  25.13,30.94 270 top
J1  47.12,51.05 270 top
J2  42.04,51.05 270 top
J3  44.58,51.05 270 top
J4  39.85,24.88 0 top
J6  1.78,29.46 270 top
J7  37.33,30.81 90 top
L1  38.4,2.79 0 top
L2  38.85,17.27 270 top
L3  37.7,10.92 180 top
L4  37.7,13.46 180 top
L5  23.75,59.72 0 top
Q1  46.99,29.53 90 top
R1  44.38,19.77 180 top
R2  47.04,19.17 270 top
R3  50.78,8.38 90 top
R4  50.9,15.12 90 top
R5  54.72,7.49 270 top
R6  54.72,14.22 90 top
R7  31.43,19.62 180 top
R8  7.62,57.85 180 top
R9  28.86,22.74 270 top
R10  7.75,39.53 0 top
R11  36.44,57.76 180 top
R12  23.74,38.2 0 top
R13  9.1,26.24 180 top
R14  9.1,24.67 180 top
R15  37.08,40.36 90 top
R16  36.45,56.13 180 top
R17  25.07,16.13 90 top
R18  33.66,3.17 0 top
R19  23.73,52.52 0 top
R20  23.73,50.75 0 top
R21  23.75,43.58 0 top
R22  23.75,45.37 0 top
R23  47.31,25.72 180 top
R31  32.51,36.58 0 top
SP2  44.77,34.92 0 top
SW1  18.16,25.91 90 top
TP1  40.69,8.65 180 top
TP2  40.69,11.76 180 top
TP3  40.69,14.86 180 top
TP4  50.78,18.54 180 top
TP5  50.78,4.97 180 top
TP6  50.77,11.76 180 top
TP7  40.69,18.29 180 top
U1  30.88,12.46 180 top
U2  14.01,30.28 270 top
U3  25.42,20.27 180 top
U4  32.15,49.78 315 top
U$1  16.94,2.16 90 top
U$19  [HEEPLOGO]  65.54,21.96 0 top
VR1  43.18,26.67 180 top
X1  26.46,3.69 0 top
X2  10.92,48.77 90 top
Y1  33.24,22.73 180 top
Y4  24.48,24.62 180 top

### Tracks (layer width: path | path; a pad name or v marks a point on that pad's centre or on a via)
3.3V
  Top 0.203: D4.C 44.74,30.8 SP2.-
9_PWM  (via drill 0.35)
  Top 0.152: v29.94,31.69 29.2,31.69 28.95,31.44 IC2.29
  Bottom 0.152: 31.11,32.39 31.07,32.35 | 31.11,32.39 34.42,35.7 37.09,35.7 38.45,37.06 38.47,37.08 44.58,43.19 J3.4 | v29.94,31.69 30.08,31.82 30.54,31.82 31.11,32.39
13
  Top 0.152: IC2.32 28.75,33.09 29.1,33.09 30.68,34.67 D5.A
+3V3  (via drill 0.35)
  Top 0.152: C32.1 20.95,59.72 L5.1 24.14,60.96 32.39,60.96 R11.2 34.9,57.76 v34.04,56.9 | C32.1 | C32.1 C33.1 10.21,59.6 R8.1 | C28.1 v27.11,41.21 C27.1 30.96,43.43 34.54,43.43 35.05,43.94 35.05,45.21 34.51,45.75 U4.28 35.08,45.09 v35.08,44.68 | C43.1 11.92,38.1 7.3,38.1 6.9,38.51 R10.1
  Top 0.203: C43.1 17.67,35.08 C34.1 | 27.51,33.91 27.36,33.76 22.9,33.76 22.75,33.91 22.75,33.97 | 27.51,33.91 27.51,34.29 IC2.34 27.63,35.58 v27.53,35.68 | IC2.44 22.75,34.29 22.75,33.97 | 22.75,33.97 22.31,33.53 22.31,31.21 22.16,31.06 21.77,31.06 IC2.6 | 27.98,33.44 IC2.33 | 27.98,33.44 27.51,33.91 | IC2.24 28.48,29.06 28.1,29.06 27.95,29.21 27.95,33.17 27.98,33.2 27.98,33.44 | U2.5 15.12,31.05 14.98,31.05 | 30.43,19.62 R7.2 | R18.2 34.51,3.9 v33.98,4.43
  Top 0.254: 17.12,30.94 15.61,30.94 U2.5 15.15,31.07 14.97,31.07 14.43,30.53 14.43,28.94 14.6,28.78 15.17,28.78 16.21,27.74 v16.33,27.74 | 17.12,30.94 IC2.6 21.72,30.87 22.14,30.87 22.5,30.51 22.5,28.47 22.83,28.14 23.37,28.14 23.54,27.98 23.54,27.56 IC2.14 | U1.23 27.79,13.81 27.34,13.81 27.11,14.05 v27.11,15.31 27.11,16.63 28.36,17.88 C16.1 | U1.40 33.52,9.47 34.61,8.38 34.61,7.64 C20.1 | 17.12,30.94 17.18,30.99 v17.18,31.07 | v16.33,26.27 16.33,25.93 17.57,24.69 17.98,24.69 18.18,24.48 18.18,23.29 18.43,23.05 v23.77,23.05 | v27.03,23.01 v25.55,23.01
  Top 0.305: U2.5 15.31,32.93 C42.1 14.93,33.34 C43.1
  Top 0.61: J2.4 J2.3 J2.2 J2.1 42.07,51.08 42.07,55.12 37.95,59.24 36.1,59.24 35.59,58.73 R11.2
  Bottom 0.152: v34.04,56.9 34.04,48.79 34.67,48.15 34.67,45.08 v35.08,44.68
  Bottom 0.203: v27.11,41.21 26.99,41.08 26.99,36.23 v27.53,35.68 | v35.08,44.68 35.08,41.52 R15.1 | C16.1 28.84,17.88 R7.2 | v33.98,4.43 33.98,6.71 C20.1
  Bottom 0.254: C20.1 34.63,7.62 29.21,7.62 26.67,10.16 26.67,10.97 | v17.18,31.07 17.18,30.74 16.33,29.89 v16.33,27.74 v16.33,26.27 16.16,26.1 | v23.77,23.05 25.51,23.05 v25.55,23.01 | R7.2 30.14,19.62 27.36,22.41 27.36,22.68 v27.03,23.01 | 26.67,10.97 | 26.67,10.97 26.67,11.8 26.02,12.45 26.02,13.56 26.09,13.63 26.09,14.15 26.2,14.26 26.47,14.53 26.47,14.67 v27.11,15.31
  other vias: 37.08,39.51 34.76,7.49 30.58,19.62 28.69,17.88
+5V  (via drill 0.35, 1)
  Top 0.254: v30.07,25.42 34.44,25.42 36.06,27.04 J7.2
  Top 0.305: D1.C 11.26,31.23 U2.1 13.03,30.91 13.46,30.91 13.67,30.7 13.67,29.86 13.46,29.65 13.03,29.65 U2.3 13.16,28.88 C41.1
  Top 2.54: U$1.V+1 16.51,2.59 v16.51,4.45 | v19.05,1.91 18.41,2.54 18.41,5.08 | U$1.V+2 15.88,3.63 15.88,1.91 | v22.86,5.71 v22.86,1.91
  Bottom 0.254: C41.1 15.23,25.44 25.37,25.44 26.37,24.44 | 26.37,24.44 U3.5 26.37,17.68 25.71,17.02 25.71,14.85 24.63,13.77 24.63,11.1 C21.+ | v30.07,25.42 29.1,24.44 26.37,24.44
  other vias: 13.16,27.51 26.37,18.97 22.54,9 15.24,0.64 17.78,0.64 16.51,0.64 19.05,0.64 20.32,0.64 21.59,0.64 22.86,0.64 21.59,1.91 20.32,1.91 17.78,1.91 16.51,1.91 15.24,1.91 15.24,3.17 16.51,3.17 17.78,3.17 19.05,3.17 20.32,3.17 20.32,4.45 19.05,4.45 17.78,4.45 15.24,4.45 15.24,5.71 16.51,5.71 17.78,5.71 19.05,5.71 20.32,5.71 21.59,5.71 22.86,6.99 21.59,6.99 20.32,6.99 19.05,6.99 17.78,6.99 17.78,8.26 19.05,8.26 20.32,8.26 20.32,9.53 19.05,9.53 17.78,9.53 21.59,8.26
  pour Top: 17.4,9.78 23.81,9.78 23.81,-2.92 14.86,-2.92 14.86,5.97 17.4,5.97
  pour Bottom: 17.4,9.78 23.81,9.78 23.81,-2.92 14.86,-2.92 14.86,5.97 17.4,5.97
A0  (via drill 0.35)
  Top 0.152: v35.58,36.37 35.23,36.72 34.91,36.72 33.82,37.81 27.77,37.81 26.43,36.48 26.43,34.96 26.48,34.91 26.48,34.73 26.71,34.5 IC2.36
  Bottom 0.152: J3.3 43.21,44.6 43.21,42.45 37.58,36.83 36.04,36.83 v35.58,36.37
A1  (via drill 0.35)
  Top 0.152: IC2.37 26.13,36.6 27.64,38.11 34.03,38.11 35.01,37.13 35.47,37.13 35.72,37.38 v36.2,37.38
  Bottom 0.152: v36.2,37.38 36.45,37.63 37.96,37.63 40.6,40.28 40.6,46.41 41.53,47.35 42.52,47.35 43.69,48.51 J3.2
A2  (via drill 0.35)
  Top 0.152: IC2.38 25.63,37.02 27.02,38.42 34.51,38.42 v35.24,37.69
  Bottom 0.152: v35.24,37.69 35.49,37.94 37.83,37.94 40,40.11 40,48.7 40.99,49.68 43.21,49.68 J3.1
ACTLED  (via drill 0.35)
  Top 0.152: v33.02,46.48 33.02,46.44 U4.27
  Bottom 0.152: v33.02,46.48 29.59,49.91 22.93,49.91 22.33,50.52 22.33,51.59 21.08,52.83 20.24,52.83 20.2,52.88 19.43,52.88 18.62,52.07 7.3,52.07 6.84,52.53 X2.12
D+  (via drill 0.35)
  Top 0.254: v12.06,28.52 12.06,25.4 11.43,24.77 10.05,24.77 R14.1 | IC2.4 21.56,32.03 20.04,32.03 19.88,32.19 v19.6,32.19
  Bottom 0.254: v12.06,28.52 13.35,29.86 15.47,29.86 15.83,30.21 15.83,32.1 15.95,32.21 19.58,32.21 v19.6,32.19
D-  (via drill 0.35)
  Top 0.254: R13.1 11.43,27.72 v11.43,29.21 | IC2.3 21.62,32.47 20.46,32.47 v20.25,32.68
  Bottom 0.254: v11.43,29.21 11.12,29.52 10.51,29.52 10.16,29.87 10.16,30.37 10.67,30.89 10.98,30.89 13.11,33.02 19.91,33.02 v20.25,32.68
GND  (via drill 0.35, 0.4, 0.5)
  Top 0.152: C33.2 C32.2 | C32.2 | C32.2 C29.2 22.89,56.12 C31.2 C30.2 | U4.48 34.61,56.13 R16.2 | U3.1 26.37,20.87 26.11,20.6 24.72,20.6 24.47,20.85 U3.3 24.48,21.58 Y4.2 | R9.1 C13.2 30.57,23.59 31.35,24.36 31.44,24.36 v31.84,24.76
  Top 0.203: U1.1 34.34,10.21 34.93,9.62 | v45.45,18.03 45.77,18 C14.2 | U1.3 34.35,11.21 35.23,10.34 v35.23,9.4 | R31.1 30.38,36.58 v30.23,36.73
  Top 0.254: C8.1 v47.36,11.81 C7.2 | C10.1 v48.75,11.81 | C9.2 v48.75,11.81 | v50.78,11.81 50.83,11.81 TP6.P$1 v50.77,11.81 v48.75,11.81 | C4.1 42.98,16.26 v42.86,16.38 | TP2.P$1 42.68,11.76 v42.86,11.94 | C11.2 C25.2 36.4,14.99 36.4,14.56 35.05,13.21 U1.7 31.63,13.21 U1.TP 29.63,13.71 U1.18 | 34.93,9.62 35.01,9.62 v35.23,9.4 36.56,8.07 C20.2 | U1.11 33.13,16.19 v33.7,16.76 | IC2.THERMAL 25.13,31.39 v24.77,31.75
  Top 0.305: C42.2 13.23,33.34 C43.2 | C26.2 20.59,38.02 C23.2 22.7,38.02 R12.1 | R12.1 24.58,39.9 C40.2 | R12.1 23.62,38.94 23.73,38.83 23.73,37.58 23.91,37.4 25.26,37.4 25.44,37.58 25.44,37.86 C28.2 28.72,39.52 C27.2 C35.2 32.16,39.51 25MHZ.4 33.97,41.2 25MHZ.2 35.02,41.8 C36.2
  Top 0.356: R5.2 v54.72,13.08 R6.1
  Top 0.406: R6.1 54.72,14.86
  Top 2.54: v19.68,18.41 v14.61,18.41
  Bottom 0.254: v42.86,16.38 42.86,16.32 | v42.86,11.94 43.12,11.94
  Bottom 0.406: v54.72,13.08 54.72,11.94
  other vias: 48.56,23.88 48.56,6.1 43.42,4.13 46.21,11.94 45.2,11.94 47.17,4.96 44.69,2.6 37.99,23.51 47.04,24.32 38.28,9.14 41.01,1.4 42.66,22.42 43.1,6.41 39.8,22.67 41.57,23.5 45.01,23.81 45.2,21.97 35.06,4.53 47.36,22.8 45.09,5.33 36.1,21.89 9.53,18.41 9.53,19.68 9.53,20.95 10.79,20.95 10.79,19.68 10.79,18.41 12.06,18.41 12.06,19.68 12.06,20.95 13.34,20.95 13.34,19.68 13.34,18.41 14.61,19.68 15.88,18.41 15.88,19.68 17.14,19.68 17.14,18.41 18.41,18.41 18.41,19.68 19.68,19.68 19.68,20.95 20.95,20.95 22.23,20.95 23.5,20.95 23.5,19.68 22.23,19.68 20.95,19.68 20.95,18.41 19.68,17.14 18.41,17.14 17.14,17.14 15.88,17.14 15.88,15.88 15.88,14.61 15.88,13.34 17.14,13.34 18.41,13.34 18.41,14.61 17.14,14.61 17.14,15.88 18.41,15.88 19.68,15.88 19.68,14.61 19.68,13.34 20.95,13.34 20.95,14.61 20.95,15.88 20.95,17.14 22.23,17.14 22.23,18.41 23.5,18.41 23.5,17.14 22.23,15.88 23.5,15.88 23.5,14.61 22.23,14.61 22.23,13.34 23.5,13.34 24.48,24.62 28.86,23.59
  pour Top: 9.27,21.72 23.62,21.72 23.62,12.83 15.62,12.83 15.62,17.91 9.27,17.91
  pour Bottom (isolate 0.254): 49.53,14.48 55.63,14.48 55.63,9.14 49.53,9.14
  pour Top (rank 2): -6.35,64.01 -6.35,-4.57 49.53,-4.57 49.53,64.01
  pour Bottom: 9.27,21.72 23.62,21.72 23.62,12.83 15.62,12.83 15.62,17.91 9.27,17.91
  pour Bottom (rank 2): -8.26,65.41 -8.26,-2.54 49.53,-2.54 49.53,65.41
INT
  Top 0.152: R11.1 37.29,57.52 38.11,56.7 38.11,49.45 U4.36
IRQ  (via drill 0.35)
  Top 0.152: v30.49,24.62 30.29,24.81 29.42,24.81 | 29.42,24.81 29.37,24.86 | v26.75,13.25 26.75,13.15 27.15,12.76 27.84,12.76 U1.25 | IC2.21 27.13,27.11 29.42,24.81
  Bottom 0.152: v30.49,24.62 30.49,20.5 31.14,19.85 31.14,19.31 30.15,18.33 30.15,18.14 27.83,15.82 27.83,14.33 v26.75,13.25
LNKLED  (via drill 0.35)
  Top 0.152: U4.25 31.48,44.69 30.62,43.83 28.33,43.83 v28.19,43.69
  Bottom 0.152: v28.19,43.69 26.21,43.69 26.17,43.74 22.05,43.74 20.32,45.47 19.56,45.47 18.29,46.74 8.89,46.74 8.26,46.1 8.26,43.5 6.9,42.14 X2.14
MISO  (via drill 0.35)
  Top 0.203: IC2.11 20.82,28.44 v20.32,27.94 | U4.34 39.26,45.15 39.26,39.13 38.79,38.66 38.79,34.85 39.8,33.85 39.8,29.47 J7.1
  Bottom 0.203: v20.32,27.94 20.71,28.33 34.21,28.33 35.46,29.58 37.3,29.58 J7.1
MOSI  (via drill 0.35)
  Top 0.152: 39.37,37.47 39.37,35.1 v39.48,34.99
  Top 0.203: IC2.10 18.2,28.94 17.95,28.68 17.46,28.68 17.26,28.89 v16.94,28.89 | 39.37,37.47 39.37,38.73 39.62,38.98 39.62,45.5 U4.35
  Bottom 0.152: v39.48,34.99 39.02,34.54 37.74,34.54 37.34,34.14 37.34,31.68
  Bottom 0.203: v16.94,28.89 17.26,28.89 17.46,28.68 33.93,28.68 J7.4 36.48,30.81 37.34,31.68
MOSI/SDA/TX  (via drill 0.35)
  Top 0.152: IC2.19 26.13,26.41 27.09,25.46 | 27.09,25.46 27.11,25.43 | v26.67,17.05 26.67,17.26 27.96,18.55 27.96,20.23 28.01,20.28 28.01,24.56 27.12,25.46 27.09,25.46 | v26.06,11.22 U1.28
  Bottom 0.152: 26.11,11.27 v26.06,11.22 25.51,11.77 25.51,13.56 25.73,13.78 25.73,14.3 26.11,14.68 26.11,16.5 v26.67,17.05
N$1
  Top 0.203: U1.4 34.44,11.71 35.23,10.92 L3.2
N$2
  Top 0.254: U1.6 36.11,12.71 L4.2
N$3
  Top 0.203: C1.2 C5.2 | 41.24,9.19 40.69,9.19 40.69,9.27
  Top 0.254: L3.1 38.55,10.64 38.65,10.55
  Top 0.406: TP1.P$1 41.24,8.7 41.24,9.19 42.34,10.29 43.4,10.29 C3.1 C1.2 | 38.34,10.86 38.65,10.55 39.8,9.4 40.56,9.4 40.69,9.27
N$4
  Top 0.356: TP5.P$1 51.67,4.08 51.67,3.94 53.45,2.16 95.61,2.16 97.64,4.19 97.64,50.3 96.62,51.32 96.62,58.05 95.61,59.06 53.45,59.06 52.69,58.3 52.69,11.94 53.71,10.92 53.71,5.46 54.98,4.19 94.59,4.19 95.61,5.21 95.61,50.3 94.59,51.32 94.59,56.27 93.83,57.03 55.23,57.03 54.72,56.52 R6.2
  Top 0.406: TP5.P$1 50.78,7.42 R3.1
N$5  (via drill 0.4, 0.5)
  Top 0.356: v97.64,51.82 97.64,58.55 96.12,60.08 52.94,60.08 51.67,58.8 51.67,19.43 TP4.P$1 | v96.62,49.79 96.62,4.7 95.1,3.17 54.21,3.17 52.69,4.7 v52.69,10.54 | v53.71,12.32 53.71,57.54 54.21,58.05 94.85,58.05 95.61,57.28 v95.61,51.82 | v94.59,49.79 94.59,5.97 93.83,5.21 55.48,5.21 54.72,5.97 R5.1 54.72,7.87
  Top 0.406: R4.2 50.9,18.42 TP4.P$1
  Bottom 0.406: v96.62,49.79 v97.64,51.82 | v52.69,10.54 v53.71,12.32 | v95.61,51.82 v94.59,49.79
N$6  (via drill 0.35, 1)
  Top 1.27: U$1.VIN-1 U$1.VIN-2
  Bottom 1.27: 9.84,6.54 8,4.7 U$1.VIN-1 7.06,8.82 7.06,35.17 10.07,38.18 14.66,38.18 17.27,40.79 X2.10
  other vias: 2.94,4.7 10.79,0.64 9.53,0.64 8.26,0.64 6.99,0.64 5.71,0.64 4.45,0.64 3.17,0.64 3.17,1.91 4.45,1.91 5.71,1.91 6.99,1.91 8.26,1.91 9.53,1.91 10.79,1.91 10.79,3.17 9.53,3.17 8.26,3.17 6.99,3.17 5.71,3.17 4.45,3.17 3.17,3.17 1.91,3.17 0.64,3.17 1.91,1.91 10.79,4.45 10.79,5.71 10.79,6.99 10.79,8.26 10.79,9.53 10.79,10.79 13.34,10.16 12.06,10.16 12.06,11.43 12.06,12.7 12.06,13.97 13.34,13.97 13.34,12.7 13.34,11.43 10.79,12.06 10.79,13.34 10.79,14.61 9.53,14.61 8.26,14.61 6.99,14.61 5.71,14.61 4.45,14.61 3.17,14.61 1.91,14.61 0.64,14.61 0.64,13.34 0.64,12.06 0.64,4.45 0.64,5.71 0.64,6.99 0.64,8.26 0.64,9.53 0.64,10.79 1.91,13.34 1.91,12.06 1.91,10.79 1.91,9.53 1.91,8.26 1.91,6.99 1.91,5.71 3.17,6.99 3.17,8.26 3.17,9.53 3.17,10.79 3.17,12.06 3.17,13.34 4.45,13.34 4.45,12.06 4.45,10.79 4.45,9.53 4.45,8.26 4.45,6.99 4.45,5.71 4.45,4.45 5.71,4.45 5.71,5.71 5.71,6.99 5.71,8.26 5.71,9.53 5.71,10.79 5.71,12.06 5.71,13.34 6.99,13.34 8.26,13.34 9.53,13.34 9.53,12.06 8.26,12.06 6.99,12.06 6.99,10.79 6.99,9.53 6.99,8.26 6.99,6.99 6.99,5.71 6.99,4.45 8.26,4.45 3.17,5.71 9.53,4.45 9.53,5.71 8.26,5.71 8.26,6.99 9.53,6.99 9.53,8.26 8.26,8.26 8.26,9.53 9.53,9.53 9.53,10.79 8.26,10.79
  pour Top: 13.59,14.86 0.25,14.86 0.25,-0.38 11.05,-0.38 11.05,9.78 13.59,9.78
  pour Bottom: 13.59,14.86 0.25,14.86 0.25,-0.38 11.05,-0.38 11.05,9.78 13.59,9.78
N$7
  Top 0.203: C12.1 36.62,23.79 | U1.14 31.75,15.57 31.75,15.99 33.34,17.57 33.34,22.86 34.01,23.53 Y1.1
  Top 0.254: 36.32,23.79 C12.1 36.42,23.53 Y1.1
N$8
  Top 0.203: U1.15 31.13,17.69 31.39,17.95 31.39,20.54 32.09,21.88 | 32.09,21.88 Y1.2 | C13.1 32.09,21.89 32.09,21.88
N$9
  Top 0.152: C15.1 47.04,19.72 R2.1
N$10  (via drill 0.35, 0.4)
  Top 0.203: 43.35,18.29 C14.1 42.86,17.47 v42.42,17.47 | v42.45,19.77 R1.2 | U1.9 34.61,14.21 v35.3,14.9
  Bottom 0.203: v42.45,19.77 42.42,19.66 v42.42,17.47 39.86,14.9 v35.3,14.9
N$11
  Top 0.203: U1.10 34.45,14.71 34.72,14.99 34.72,17.78 34.91,17.97 34.91,18.64 37.22,20.95 46.41,20.95 | 45.27,19.74 R1.1 46.41,20.95 | 45.27,19.74 45.39,19.68 | 44.96,19.74 45.27,19.74 | C15.2 48.43,20.14 47.62,20.95 46.67,20.95 46.41,20.95
N$12  (via drill 0.35)
  Top 0.203: TP3.P$1 TP7.P$1
  Top 0.406: C2.1 C6.1 C4.2 42.92,13.46 42.1,13.46 40.7,14.86 TP3.P$1 40.18,14.35 39.93,14.35 39.04,13.46 L4.1
  Bottom 0.152: R2.2 47.04,17.41 45.91,16.29 45.91,13.67 C2.1
  other vias: 45.96,13.62 47.04,18.32
N$13
  Top 0.254: U1.8 34.97,13.71 35.99,14.73 35.99,15.49 36.5,16 C25.1 C11.1 35.71,18.71 36.18,19.17 38.22,19.17 38.85,18.54 L2.1
N$14  (via drill 0.4)
  Top 0.203: v37.01,4.45 38.06,5.5 C19.1 | v36.5,12.13 36.41,12.21 U1.5
  Top 0.254: 37.01,4.57 v37.01,4.45 37.01,3.24 L1.1
  Bottom 0.305: v36.5,12.13 36.5,5.08 37.01,4.57 v37.01,4.45
N$15  (via drill 1)
  Top 1.27: v2.41,43.86 3.84,43.86 6.2,46.22 11.99,46.22 16.65,41.56 17.89,41.56 18.76,42.44 18.76,43.27 X2.9 | U$1.VIN+2 U$1.VIN+1
  Bottom 1.27: v2.41,43.86 2.41,34.15 3.42,33.14 3.42,25.79 2.94,25.3 U$1.VIN+1
  other vias: 2.94,20.91
N$16  (via drill 0.35)
  Top 0.152: U4.22 30.07,45.4 29.56,44.89 28.45,44.89 v25.94,42.37
  Bottom 0.152: v25.94,42.37 22.56,42.37 18.89,38.7 C26.1
  other vias: 18.89,38.03
N$17
  Top 0.203: IC2.16 24.63,26.85 23.87,26.09 23.18,25.4 23.18,24.72 Y4.3
N$18  (via drill 0.35)
  Top 0.152: U4.20 29.36,46.11 28.85,45.6 28.35,45.6 v25.94,43.18 | v20.83,41.66 20.83,39.82 C23.1
  Bottom 0.152: v25.94,43.18 22.35,43.18 v20.83,41.66
N$19
  Top 0.152: R17.2 25.07,18.37 U3.4
N$20  (via drill 0.35)
  Top 0.152: U4.10 27.02,52.44 v27.02,52.68 | R12.2 24.59,38.61 25.38,39.41 25.38,43.92 25.65,44.2 25.74,44.29 25.74,47.87 25.98,48.11 25.98,49.97 v26.48,50.47
  Bottom 0.152: v27.02,52.68 26.77,52.43 26.77,51.61 26.48,51.32 v26.48,50.47
N$21
  Top 0.203: IC2.17 25.13,25.99 25.72,25.4 25.72,24.66 Y4.1
N$22
  Top 0.254: J6.3 5.46,29.46 6.35,28.57 6.35,26.57 R14.2
N$23
  Top 0.152: C40.1 23.67,40.77 23.67,42.39 22.9,43.16 R21.1 R22.1
N$24
  Top 0.254: J6.2 5.45,30.11 8.26,27.3 R13.2
N$25  (via drill 0.35)
  Top 0.152: C35.1 31.15,41.8 25MHZ.3 | U4.31 34.54,47.75 34.29,47.75 v34.04,48.01
  Bottom 0.152: 25MHZ.3 32.22,44.9 33.58,46.25 33.58,46.95 33.56,46.97 33.56,47.53 v34.04,48.01
  other vias: 32.22,41.81
N$26  (via drill 0.35)
  Top 0.152: C36.1 v34.03,39.51 25MHZ.1 | U4.30 34.95,46.46 34.44,46.97 34.34,46.97 v34.12,47.2
  Bottom 0.152: v34.12,47.2 34.12,39.6 v34.03,39.51
N$27
  Top 0.152: R8.2 6.77,55.47 X2.11
N$28
  Top 0.152: R10.2 8.6,42.93 X2.13
N$29
  Top 0.203: R23.1 48.16,28.41 Q1.1
N$30
  Top 0.203: Q1.3 42.86,29.53 D4.A 41.59,32.75 SP2.+
N$31
  Top 0.203: VR1.2 45.91,25.17 R23.2
N$33
  Top 0.152: D5.C 33.56,36.38 R31.2
N$55
  Top 0.203: U1.37 31.63,8.67 31.42,8.47 31.42,7.46 32.13,6.76 C22.2
NEO_3V  (via drill 0.35)
  Top 0.152: IC2.12 21.93,27.46 v21.86,27.39 | v23.54,26.58 22.45,25.5 v22.45,23.65
  Bottom 0.152: v21.86,27.39 22.73,27.39 v23.54,26.58 | v22.45,23.65 23.22,22.89 23.22,22.81 23.6,22.43 25.06,22.43 25.42,22.08 U3.2
  other vias: 25.42,21.57
NEO_5V
  Top 0.152: X1.2 26.46,10.04 25.51,10.99 25.51,13.33 25.12,13.72 25.12,15.23 R17.1
NSS/SCL/RX
  Top 0.152: U1.27 27.74,11.86 27.36,11.86 26.11,13.11 26.11,17.28 27.65,18.82 27.65,20.35 27.7,20.41 27.7,23.75 26.26,25.19 26.26,25.56 25.63,26.2 IC2.18
RD+  (via drill 0.35)
  Top 0.152: C38.2 21.34,43.35 v21.34,48.77 | v21.08,51.56 20.75,51.9 20.75,52.33 19.81,53.26 X2.1
  Bottom 0.152: v21.34,48.77 21.08,49.02 v21.08,51.56
RD-  (via drill 0.35)
  Top 0.152: X2.2 18.63,51.86 v18.63,49.03
  Bottom 0.152: v18.63,49.03 19.86,47.8 20.2,47.8 20.83,47.17 C39.2
  other vias: 22.91,47.17
RDN  (via drill 0.35)
  Top 0.152: R22.2 C39.1 24.61,47.6 25.37,48.36 25.37,51.42 v25.91,51.96 | v27.43,55.37 27.62,55.37 U4.5
  Bottom 0.152: v25.91,51.96 25.91,53.85 v27.43,55.37
RDP  (via drill 0.35)
  Top 0.152: C38.1 24.59,43.57 R21.2 25.43,44.42 25.43,47.99 25.67,48.23 25.67,50.8 v25.93,51.05 | v27.43,54.56 27.73,54.56 U4.6
  Bottom 0.152: v25.93,51.05 25.93,51.19 26.46,51.73 26.46,53.6 v27.43,54.56
RST  (via drill 0.35)
  Top 0.203: 21.34,26.29 v21.18,26.13
  Top 0.254: SW1.4 v21.18,26.13 | 21.34,26.29 21.84,26.78 22.87,26.78 23.03,26.95 23.03,27.37 IC2.13
  Bottom 0.152: v21.18,26.13 23.21,26.13 23.31,26.03 23.77,26.03 24.12,26.37 28.85,26.37 29.1,26.62 38.6,26.62 39.77,27.79 39.77,29.71 39.84,29.79 39.84,32.11 J7.5
  Bottom 0.203: v21.18,26.13 20.32,26.99 19.37,26.99 18.96,27.39 SW1.2
  other vias: 18.96,27.91
RSTPD_N  (via drill 0.35)
  Top 0.152: IC2.20 26.63,26.73 v27.54,25.82 | U1.38 32.13,9.03 32.07,8.97 32.07,8.29 v32,8.23 | R18.1 30.63,5.35 v30.63,8.23
  Bottom 0.152: v27.54,25.82 29.62,25.82 29.82,26.02 30.33,26.02 31.04,25.31 31.04,21.65 32.84,19.85 32.84,19.39 32.1,18.65 32.1,10.99 32,10.89 v32,8.23 v30.63,8.23
SCK  (via drill 0.35)
  Top 0.203: IC2.9 17.88,29.44 v17.7,29.26 | 38.36,39.73 38.36,45.34 U4.33 | 38.36,39.73 v38.36,39.69 | J7.3 38.6,31.67 37.41,32.86 37.41,38.13 38.36,39.73
  Bottom 0.203: v17.7,29.26 24.69,29.26 34,38.58 37.47,38.58 38.02,39.12 38.02,39.34 v38.36,39.69
SCSN_WIZ  (via drill 0.35)
  Top 0.152: R15.2 36.58,41.72 36.58,46.48 35.89,47.17 U4.32
  Top 0.203: IC2.8 17.24,29.94 v17.14,29.84
  Bottom 0.203: v17.14,29.84 24.77,29.84 33.85,38.93 37.33,38.93 37.66,39.27 37.66,39.75 37.08,40.33 R15.2
  other vias: 37.08,41.21
SEL0  (via drill 0.35)
  Top 0.203: U1.16 30.63,18.02 v30.71,18.1
  Bottom 0.203: v30.71,18.1 32.23,19.62 R7.1
  other vias: 32.28,19.62
SEL1
  Top 0.203: U1.17 30.13,18.67 29.78,19.02 29.78,20.97 R9.2
SPEAKER
  Top 0.203: IC2.31 28.73,32.32 30.13,32.32 33.42,29.03 33.42,27.36 33.76,27.02 34.24,27.02 34.82,27.6 34.82,28.79 35.55,29.52 36.58,29.52 37.41,28.69 37.41,27.78 39.85,25.34 J4.1 42.18,27.21 VR1.3
TDN  (via drill 0.35)
  Top 0.152: R20.1 22.47,50.75 20.2,48.47 17.61,48.47 X2.6 | U4.1 30.78,54.88 29.42,56.23 26.7,56.23 v25.62,55.15
  Bottom 0.152: v25.62,55.15 23.55,53.08 22.65,53.08 22.32,52.75 22.32,52.29 22.88,51.73 R20.1
  other vias: 22.88,50.75
TDP  (via drill 0.35)
  Top 0.152: X2.5 22.88,52.47 R19.1 | v26.62,55.37 26.65,55.37 27.2,55.93 29.19,55.93 U4.2
  Bottom 0.152: v26.62,55.37 23.78,52.52 R19.1
  other vias: 22.88,52.52
TX1_ANTENNA
  Top 0.203: C9.1 C7.1 C1.1 C5.1
  Top 0.406: C9.1 48.8,8.73 49.39,8.73 50,9.33 50.77,9.33 R3.2
TX2_ANTENNA
  Top 0.203: C10.2 C8.2 C2.2 C6.2
  Top 0.406: C10.2 49.16,15.42 50.25,14.33 50.74,14.33 R4.1
VBUS  (via drill 0.35)
  Top 0.254: v15.22,30.46 21.63,30.46 IC2.7 | J6.1 8.03,30.76 D1.A 9.11,30.12 v10.77,30.12
  Top 0.305: 8.48,29.49 D1.A
  Bottom 0.254: v15.22,30.46 15.21,30.48 11.12,30.48 v10.77,30.12
VCC  (via drill 0.35)
  Top 0.152: L1.2 39.16,2.73 38.94,2.5
  Top 0.203: 32.63,8.58 32.63,8.53 33.87,7.29 33.87,6.72 C18.1 36.17,4.42 36.17,2.57 36.84,1.91 37.27,1.91
  Top 0.254: 32.63,8.58 v32.63,8.74 U1.39 | v38.73,15.56 38.85,15.67 L2.2 | 37.27,1.91 38.34,1.91 38.94,2.5 39.34,2.9 | L1.2 40.9,2.79 C24.1
  Bottom 0.254: v38.73,15.56 38.69,15.51 35.05,15.51 34.69,15.15 34.69,10.81 v32.63,8.74
VCCA  (via drill 0.35)
  Top 0.152: L5.2 24.6,57.92 C29.1 24.59,56.12 C31.1 C30.1 | C30.1 | C30.1 R19.2 | R19.2 R20.2 24.58,48.96 C37.1 | U4.4 29.89,53.64 30.4,53.13 30.4,52.94 29.72,52.26 v29.72,51.31 29.57,51.31 U4.8 | R19.2 26.23,52.52 U4.11 v28.28,50.48 v28.28,49.36 28.28,48.56 27.77,48.05 U4.15 | U4.21 30.99,46.85 v30.99,46.99 | v29.72,48.26 28.63,47.17 U4.17
  Bottom 0.152: v28.28,50.48 28.89,50.48 v29.72,51.31 | v30.99,46.99 v29.72,48.26 28.62,49.36 v28.28,49.36
WIZ_RST  (via drill 0.35)
  Top 0.152: R16.1 37.3,52.31 37.76,51.86 37.76,51.67 37.24,51.16 U4.37 37.24,50.88 v36.09,49.73 | IC2.22 28.09,27.46 v28.62,26.93 | v34,27.6 34,33.58 34.53,34.11 v34.53,36.31
  Bottom 0.152: v28.62,26.93 33.33,26.93 v34,27.6 | v36.09,49.73 36.09,43 38.92,40.16 38.92,39.46 37.71,38.24 34.89,38.24 34.53,37.88 v34.53,36.31

### Text on the board
tPlace: 3v3 | GND | PN532 RFID/NFC | A2 | 13.56MHz RFID | A1 | A0 | 9 | ~ | PIEZO | ~ | 5 | 13 | 11 | @5V | 5 | V | GND
tNames: C15 | RX | C4 | TX2 | TX2 | C6 | C2 | C8 | C10 | R4 | L4 | L3 | TX1 | R3 | C5 | C1 | C7 | C9 | TX1 | C3 | C15 | RX | C4 | TX2 | C6 | C2 | C8 | C10 | TX2 | R4 | L4 | L3 | TX1 | R3 | C5 | C1 | C7 | C9 | TX1 | C3